# Altium project fader2_pcb.PrjPcb (part 1 of 2)
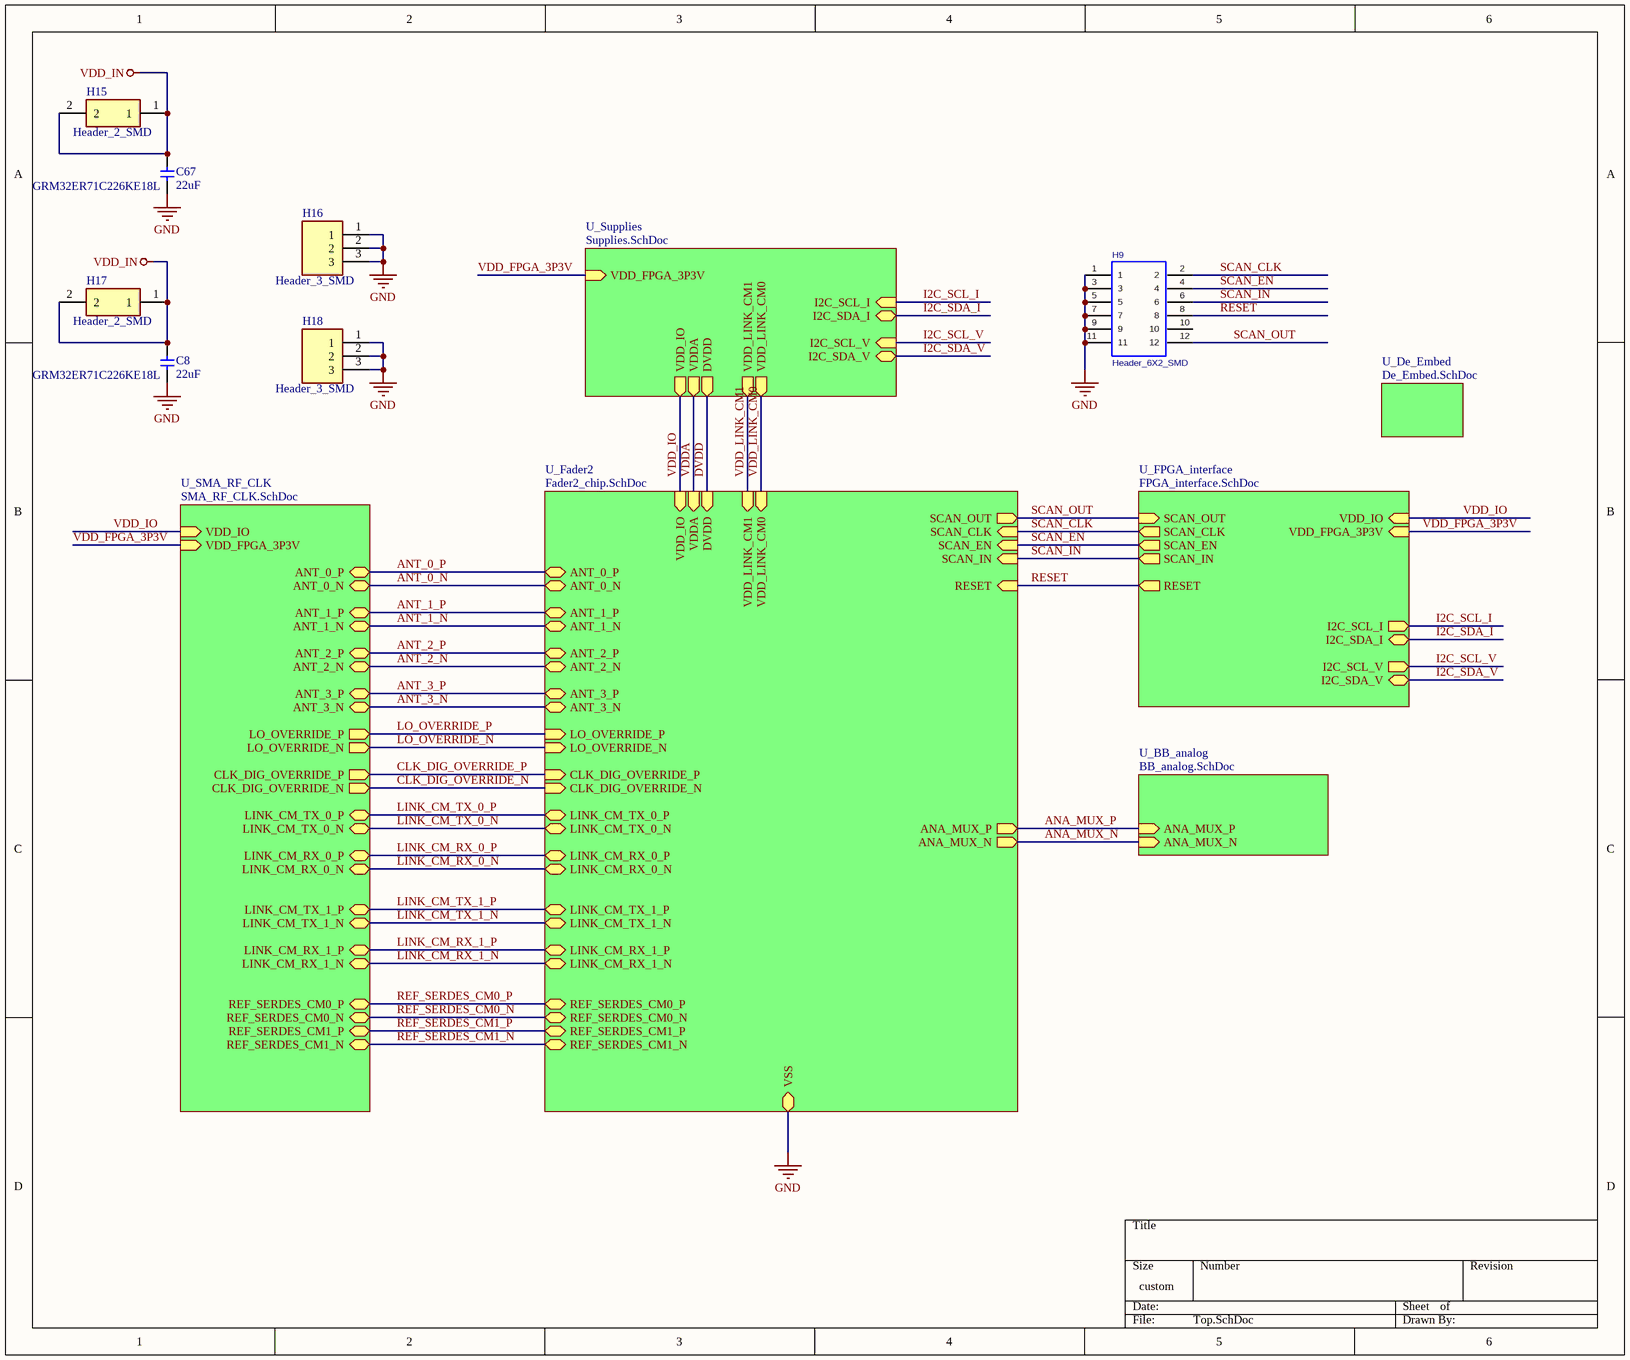
[diagram p0: Top.SchDoc]
10 sheets, 206 parts. Net scope: hierarchical (ports join the sheet entries above them; power ports are global).
Board file: fader2_blind_vias_pcb.PcbDoc
Sheets:
  Top.SchDoc
    U_SMA_RF_CLK = SMA_RF_CLK.SchDoc
    U_FPGA_interface = FPGA_interface.SchDoc
      U_Lvl_Shifters = Lvl_Shifters.SchDoc
    U_Supplies = Supplies.SchDoc
      U_Supplies_LDO = Supplies_LDOs.SchDoc
      U_Supplies_Isense = Supplies_Isense.SchDoc
      U_Supplies_Pots = Supplies_Pots.SchDoc
    U_De_Embed = De_Embed.SchDoc
    U_BB_analog = BB_analog.SchDoc

## Sheet Top.SchDoc
size 304 x 254 mm

### Parts
C8  22uF  Supplier Part Number 1: GRM32ER71C226KE18L  [CAPC3225X27N]
C67  22uF  Supplier Part Number 1: GRM32ER71C226KE18L  [CAPC3225X27N]
H9  Header_6X2_SMD  [HDR2X6_SMD]
H15  Header_2_SMD  [HDR1X2_SMD_S]
H16  Header_3_SMD  [HDR1X3_SMD]
H17  Header_2_SMD  [HDR1X2_SMD_S]
H18  Header_3_SMD  [HDR1X3_SMD]

### Sub-sheets
U_BB_analog = BB_analog.SchDoc: ANA_MUX_N (in), ANA_MUX_P (in)
U_De_Embed = De_Embed.SchDoc: no entries
U_Fader2 = Fader2_chip.SchDoc (file not in this document): VSS (bidir), SCAN_OUT (out), SCAN_CLK (in), SCAN_EN (in), SCAN_IN (in), ANT_2_N (bidir), LINK_CM_RX_0_N (bidir), LINK_CM_TX_0_P (bidir), LINK_CM_RX_0_P (bidir), RESET (in), LINK_CM_TX_0_N (bidir), ANT_1_N (bidir), ANT_2_P (bidir), ANT_3_N (bidir), ANT_0_P (bidir), ANT_3_P (bidir), ANT_1_P (bidir), ANT_0_N (bidir), CLK_DIG_OVERRIDE_P (in), LO_OVERRIDE_N (in), ANA_MUX_N (out), ANA_MUX_P (out), LO_OVERRIDE_P (in), CLK_DIG_OVERRIDE_N (in), DVDD (in), VDD_IO (in), VDDA (in), VDD_LINK_CM0 (in), VDD_LINK_CM1 (in), LINK_CM_TX_1_P (bidir), LINK_CM_TX_1_N (bidir), LINK_CM_RX_1_P (bidir), LINK_CM_RX_1_N (bidir), REF_SERDES_CM1_N (bidir), REF_SERDES_CM1_P (bidir), REF_SERDES_CM0_N (bidir), REF_SERDES_CM0_P (bidir)
U_FPGA_interface = FPGA_interface.SchDoc: I2C_SDA_I (bidir), I2C_SDA_V (bidir), VDD_FPGA_3P3V (in), VDD_IO (in), I2C_SCL_V (out), I2C_SCL_I (out), SCAN_OUT (in), RESET (out), SCAN_EN (out), SCAN_IN (out), SCAN_CLK (out)
U_SMA_RF_CLK = SMA_RF_CLK.SchDoc: LO_OVERRIDE_P (out), CLK_DIG_OVERRIDE_N (out), CLK_DIG_OVERRIDE_P (out), LO_OVERRIDE_N (out), VDD_IO (in), VDD_FPGA_3P3V (in), ANT_3_N (bidir), ANT_3_P (bidir), ANT_1_P (bidir), ANT_2_N (bidir), ANT_0_N (bidir), ANT_1_N (bidir), ANT_0_P (bidir), ANT_2_P (bidir), LINK_CM_RX_0_N (bidir), LINK_CM_RX_0_P (bidir), LINK_CM_TX_0_N (bidir), LINK_CM_TX_0_P (bidir), LINK_CM_RX_1_N (bidir), LINK_CM_RX_1_P (bidir), LINK_CM_TX_1_N (bidir), LINK_CM_TX_1_P (bidir), REF_SERDES_CM0_N (bidir), REF_SERDES_CM1_P (bidir), REF_SERDES_CM1_N (bidir), REF_SERDES_CM0_P (bidir)
U_Supplies = Supplies.SchDoc: I2C_SDA_I (bidir), I2C_SDA_V (bidir), VDD_FPGA_3P3V (in), DVDD (out), VDDA (out), VDD_IO (out), I2C_SCL_V (in), I2C_SCL_I (in), VDD_LINK_CM1 (out), VDD_LINK_CM0 (out)

### Nets
GND: C8.2 C67.2 H9.1 H9.3 H9.5 H9.7 H9.9 H9.11 H16.1 H16.2 H16.3 H18.1 H18.2 H18.3 ; sheet U_Fader2/VSS
VDD_IN: C8.1 C67.1 H15.1 H15.2 H17.1 H17.2
ANA_MUX_N: sheet U_Fader2/ANA_MUX_N, sheet U_BB_analog/ANA_MUX_N
ANA_MUX_P: sheet U_Fader2/ANA_MUX_P, sheet U_BB_analog/ANA_MUX_P
ANT_0_N: sheet U_Fader2/ANT_0_N, sheet U_SMA_RF_CLK/ANT_0_N
ANT_0_P: sheet U_Fader2/ANT_0_P, sheet U_SMA_RF_CLK/ANT_0_P
ANT_1_N: sheet U_Fader2/ANT_1_N, sheet U_SMA_RF_CLK/ANT_1_N
ANT_1_P: sheet U_Fader2/ANT_1_P, sheet U_SMA_RF_CLK/ANT_1_P
ANT_2_N: sheet U_Fader2/ANT_2_N, sheet U_SMA_RF_CLK/ANT_2_N
ANT_2_P: sheet U_Fader2/ANT_2_P, sheet U_SMA_RF_CLK/ANT_2_P
ANT_3_N: sheet U_Fader2/ANT_3_N, sheet U_SMA_RF_CLK/ANT_3_N
ANT_3_P: sheet U_Fader2/ANT_3_P, sheet U_SMA_RF_CLK/ANT_3_P
CLK_DIG_OVERRIDE_N: sheet U_Fader2/CLK_DIG_OVERRIDE_N, sheet U_SMA_RF_CLK/CLK_DIG_OVERRIDE_N
CLK_DIG_OVERRIDE_P: sheet U_Fader2/CLK_DIG_OVERRIDE_P, sheet U_SMA_RF_CLK/CLK_DIG_OVERRIDE_P
DVDD: sheet U_Fader2/DVDD, sheet U_Supplies/DVDD
I2C_SCL_I: sheet U_FPGA_interface/I2C_SCL_I, sheet U_Supplies/I2C_SCL_I
I2C_SCL_V: sheet U_FPGA_interface/I2C_SCL_V, sheet U_Supplies/I2C_SCL_V
I2C_SDA_I: sheet U_FPGA_interface/I2C_SDA_I, sheet U_Supplies/I2C_SDA_I
I2C_SDA_V: sheet U_FPGA_interface/I2C_SDA_V, sheet U_Supplies/I2C_SDA_V
LINK_CM_RX_0_N: sheet U_Fader2/LINK_CM_RX_0_N, sheet U_SMA_RF_CLK/LINK_CM_RX_0_N
LINK_CM_RX_0_P: sheet U_Fader2/LINK_CM_RX_0_P, sheet U_SMA_RF_CLK/LINK_CM_RX_0_P
LINK_CM_RX_1_N: sheet U_Fader2/LINK_CM_RX_1_N, sheet U_SMA_RF_CLK/LINK_CM_RX_1_N
LINK_CM_RX_1_P: sheet U_Fader2/LINK_CM_RX_1_P, sheet U_SMA_RF_CLK/LINK_CM_RX_1_P
LINK_CM_TX_0_N: sheet U_Fader2/LINK_CM_TX_0_N, sheet U_SMA_RF_CLK/LINK_CM_TX_0_N
LINK_CM_TX_0_P: sheet U_Fader2/LINK_CM_TX_0_P, sheet U_SMA_RF_CLK/LINK_CM_TX_0_P
LINK_CM_TX_1_N: sheet U_Fader2/LINK_CM_TX_1_N, sheet U_SMA_RF_CLK/LINK_CM_TX_1_N
LINK_CM_TX_1_P: sheet U_Fader2/LINK_CM_TX_1_P, sheet U_SMA_RF_CLK/LINK_CM_TX_1_P
LO_OVERRIDE_N: sheet U_Fader2/LO_OVERRIDE_N, sheet U_SMA_RF_CLK/LO_OVERRIDE_N
LO_OVERRIDE_P: sheet U_Fader2/LO_OVERRIDE_P, sheet U_SMA_RF_CLK/LO_OVERRIDE_P
REF_SERDES_CM0_N: sheet U_Fader2/REF_SERDES_CM0_N, sheet U_SMA_RF_CLK/REF_SERDES_CM0_N
REF_SERDES_CM0_P: sheet U_Fader2/REF_SERDES_CM0_P, sheet U_SMA_RF_CLK/REF_SERDES_CM0_P
REF_SERDES_CM1_N: sheet U_Fader2/REF_SERDES_CM1_N, sheet U_SMA_RF_CLK/REF_SERDES_CM1_N
REF_SERDES_CM1_P: sheet U_Fader2/REF_SERDES_CM1_P, sheet U_SMA_RF_CLK/REF_SERDES_CM1_P
RESET: H9.8 ; sheet U_Fader2/RESET, sheet U_FPGA_interface/RESET
SCAN_CLK: H9.2 ; sheet U_Fader2/SCAN_CLK, sheet U_FPGA_interface/SCAN_CLK
SCAN_EN: H9.4 ; sheet U_Fader2/SCAN_EN, sheet U_FPGA_interface/SCAN_EN
SCAN_IN: H9.6 ; sheet U_Fader2/SCAN_IN, sheet U_FPGA_interface/SCAN_IN
SCAN_OUT: H9.12 ; sheet U_Fader2/SCAN_OUT, sheet U_FPGA_interface/SCAN_OUT
VDD_FPGA_3P3V: sheet U_SMA_RF_CLK/VDD_FPGA_3P3V, sheet U_FPGA_interface/VDD_FPGA_3P3V, sheet U_Supplies/VDD_FPGA_3P3V
VDD_IO: sheet U_Fader2/VDD_IO, sheet U_SMA_RF_CLK/VDD_IO, sheet U_FPGA_interface/VDD_IO, sheet U_Supplies/VDD_IO
VDD_LINK_CM0: sheet U_Fader2/VDD_LINK_CM0, sheet U_Supplies/VDD_LINK_CM0
VDD_LINK_CM1: sheet U_Fader2/VDD_LINK_CM1, sheet U_Supplies/VDD_LINK_CM1
VDDA: sheet U_Fader2/VDDA, sheet U_Supplies/VDDA

Not connected (* = marked no-connect by the designer): H9 10

### Library data of the parts
C8 C67 = cap 22uF: CAP CER 22uF 10% 16V X7R 1210; Manufacturer: Murata; Manufacturer ID: GRM32ER71C226KE18L; Digikey ID: 490-4524-1-ND; Value: 22uF; Package: 1210; Supplier 1: Arrow
H9 = Header_6X2_SMD: Connector Header Vertical Dual Row, SMD, 12 position 0.100" (2.54mm); MANUFACTURER: SAMTEC; PCB DECAL: TSM-106-XX-XXX-DV; Supplier 1: Digi-Key; Supplier Part Number 1: SAM10803-ND; CREATED: November 23, 2017 - Wendy Xin
H15 H17 = Header_2_SMD: Connector Header Vertical, SMD, 2 position 0.100" (2.54mm); Manufacturer_Name: SAMTEC; Manufacturer_Part_Number: TSM-102-01-S-SV; Datasheet Link: https://componentsearchengine.com/Datasheets/2/TSM-102-01-S-SV.pdf; Arrow Part Number: TSM-102-01-S-SV; Arrow Price/Stock: https://www.arrow.com/en/products/tsm-102-01-s-sv/samtec; Mouser Part Number: 200-TSM10201SSV; Mouser Price/Stock: https://www.mouser.co.uk/ProductDetail/Samtec/TSM-102-01-S-SV?qs=FESYatJ8odJNSemiJZ%2Fyzw%3D%3D; Supplier 1: Digi-Key; Supplier Part Number 1: SAM10783-ND
H16 H18 = Header_3_SMD: Connector Header Vertical, SMD, 3 position 0.100" (2.54mm); Manufacturer_Name: SAMTEC; Manufacturer_Part_Number: TSM-103-01-S-SV-P-TR; Datasheet Link: http://suddendocs.samtec.com/prints/tsm-1xx-xx-xxx-sv-xx-xxx-xx-mkt.pdf; Height: 11.17mm; Arrow Part Number: TSM-103-01-S-SV-P-TR; Arrow Price/Stock: https://www.arrow.com/en/products/tsm-103-01-s-sv-p-tr/samtec; Mouser Part Number: 200-TSM10301SSVPTR; Mouser Price/Stock: https://www.mouser.co.uk/ProductDetail/Samtec/TSM-103-01-S-SV-P-TR?qs=FESYatJ8odJI6Ns4akqicQ%3D%3D; Supplier 1: Newark; Supplier 2: Digi-Key; Supplier Part Number 1: 80K8300; Supplier Part Number 2: SAM13283CT-ND

## Sheet SMA_RF_CLK.SchDoc
size 330 x 1066 mm
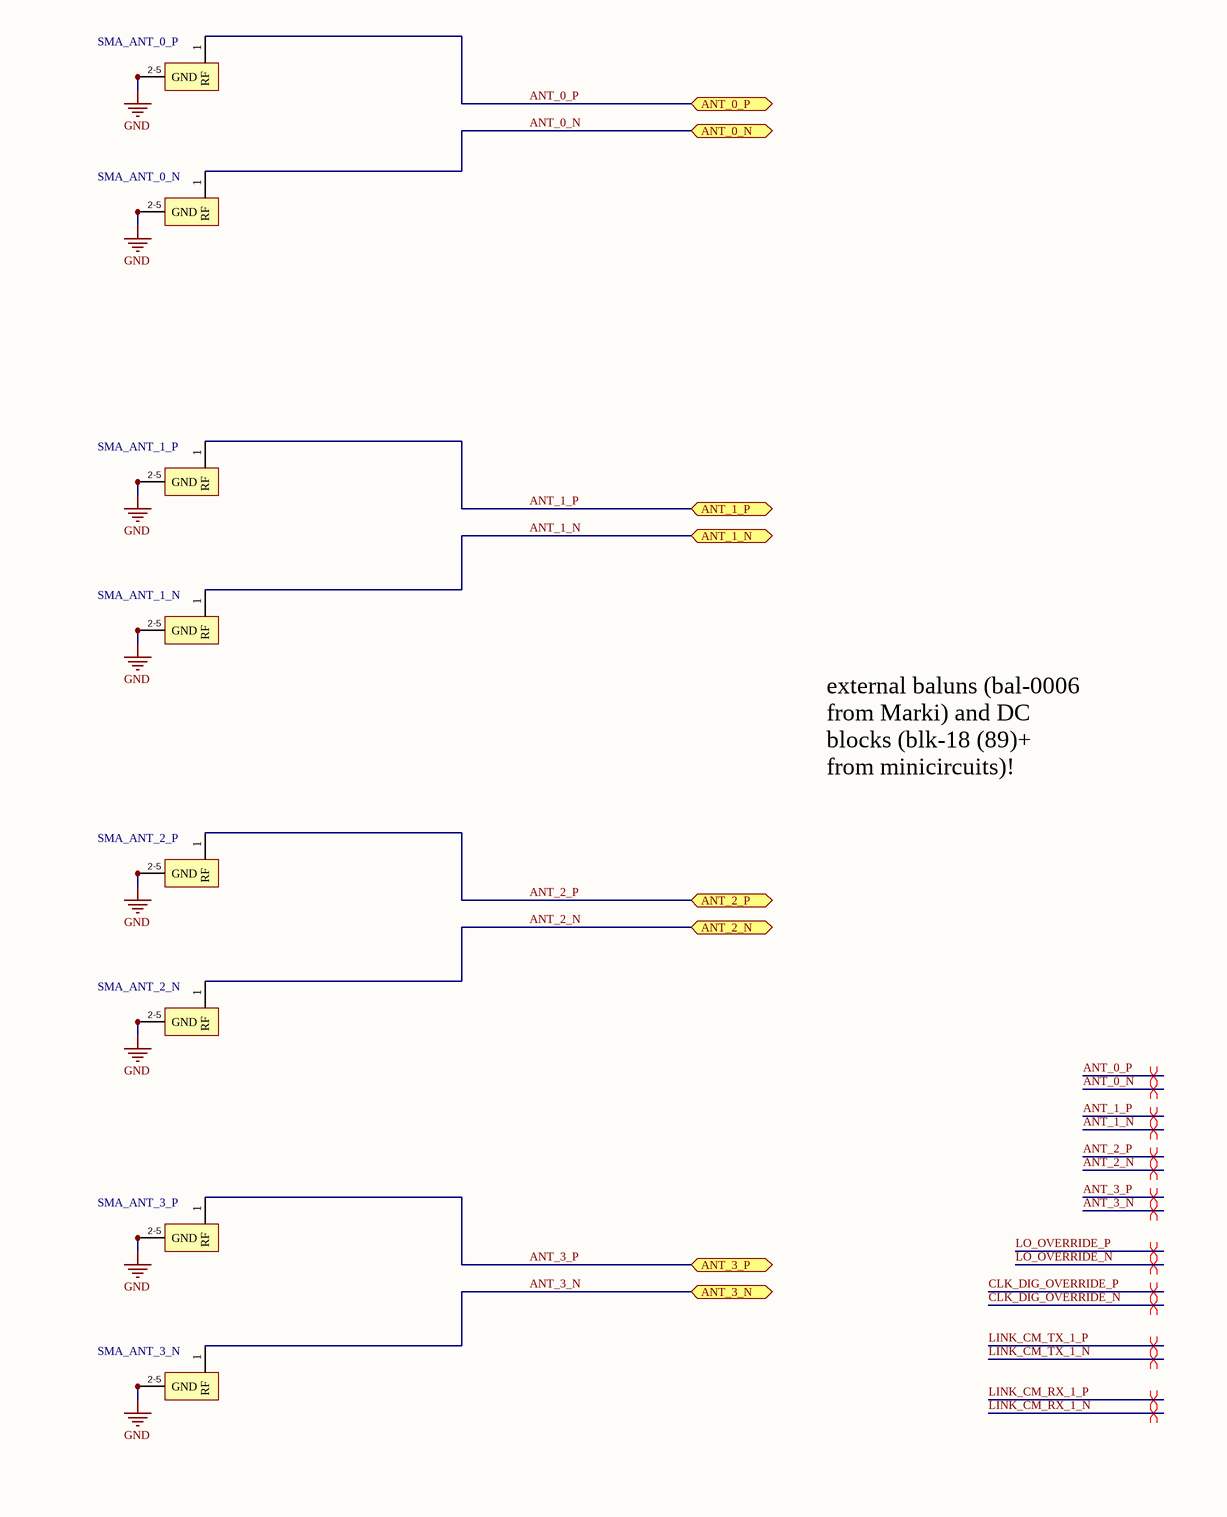
[diagram p1: SMA_RF_CLK.SchDoc, top]
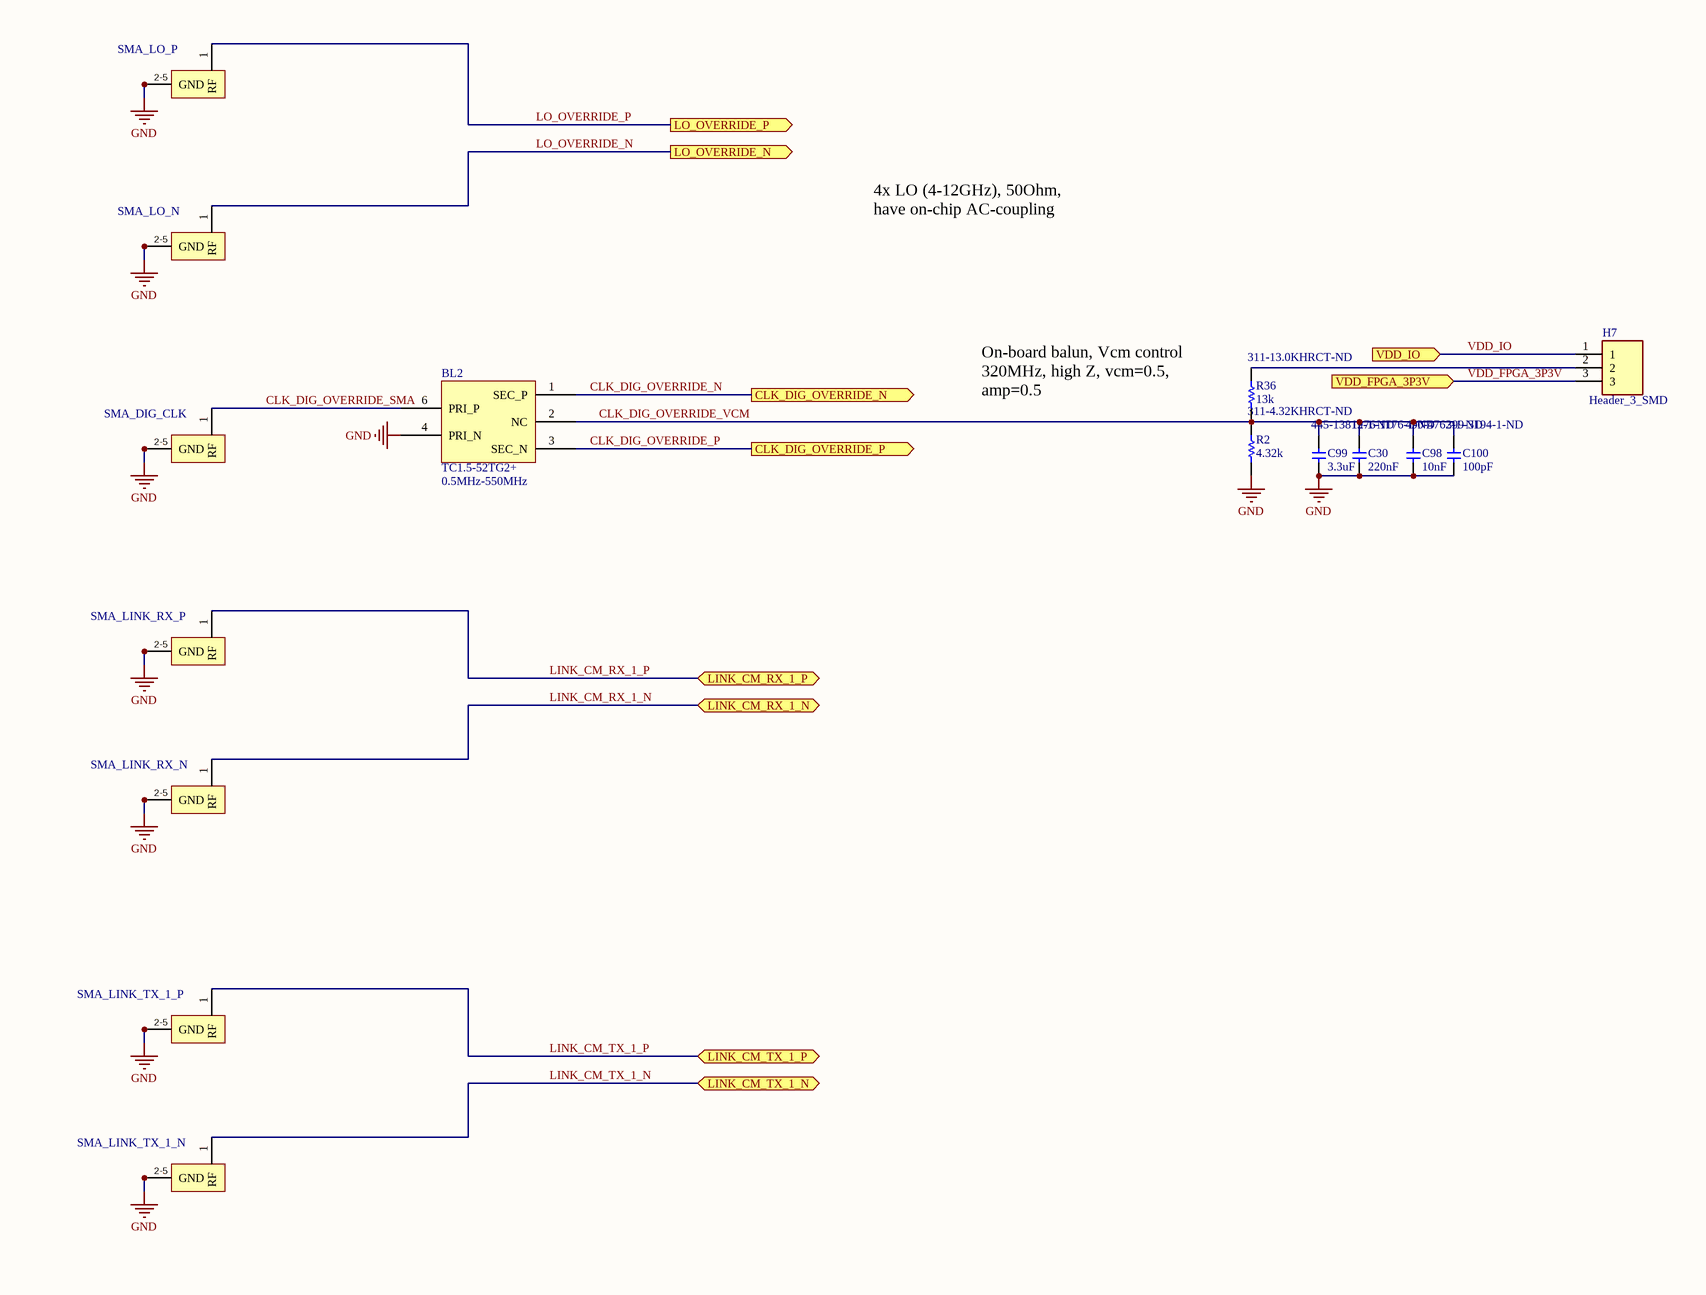
[diagram p2: SMA_RF_CLK.SchDoc, centre]
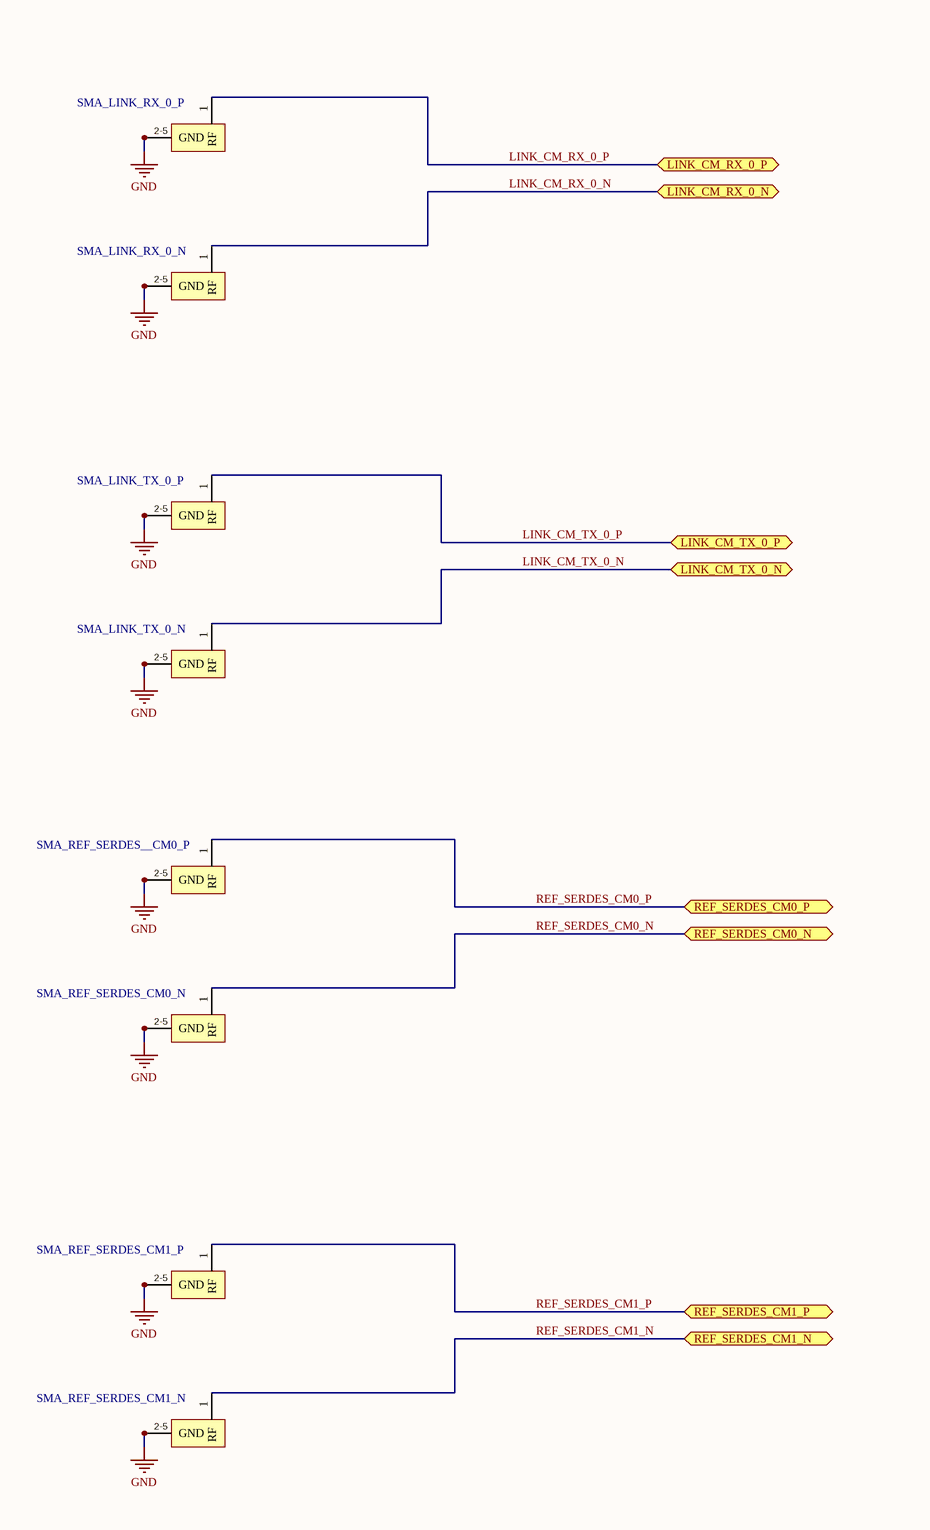
[diagram p3: SMA_RF_CLK.SchDoc, bottom]

### Parts
BL2  TC1.5-52TG2+  Frequency Range: 0.5MHz-550MHz  [AT224-3]
C30  220nF  Supplier Part Number 1: 1276-1176-1-ND  [CAP_0402]
C98  10nF  Supplier Part Number 1: 490-4762-1-ND  [CAPC1005X06L_HD]
C99  3.3uF  Supplier Part Number 1: 445-13819-1-ND  [CAP_0402]
C100  100pF  Supplier Part Number 1: 399-3194-1-ND  [CAPC1005X06L_HD]
H7  Header_3_SMD  [HDR1X3_SMD]
R2  4.32k  Supplier Part Number 1: 311-4.32KHRCT-ND  [RES_0603]
R36  13k  Supplier Part Number 1: 311-13.0KHRCT-ND  [RES_0603]
SMA_ANT_0_N  CONSMA001-SMD-G  [CON-SMA-SMD]  (value not drawn)
SMA_ANT_0_P  CONSMA001-SMD-G  [CON-SMA-SMD]  (value not drawn)
SMA_ANT_1_N  CONSMA001-SMD-G  [CON-SMA-SMD]  (value not drawn)
SMA_ANT_1_P  CONSMA001-SMD-G  [CON-SMA-SMD]  (value not drawn)
SMA_ANT_2_N  CONSMA001-SMD-G  [CON-SMA-SMD]  (value not drawn)
SMA_ANT_2_P  CONSMA001-SMD-G  [CON-SMA-SMD]  (value not drawn)
SMA_ANT_3_N  CONSMA001-SMD-G  [CON-SMA-SMD]  (value not drawn)
SMA_ANT_3_P  CONSMA001-SMD-G  [CON-SMA-SMD]  (value not drawn)
SMA_DIG_CLK  CONSMA001-SMD-G  [CON-SMA-SMD]  (value not drawn)
SMA_LINK_RX_0_N  CONSMA001-SMD-G  [CON-SMA-SMD]  (value not drawn)
SMA_LINK_RX_0_P  CONSMA001-SMD-G  [CON-SMA-SMD]  (value not drawn)
SMA_LINK_RX_N  CONSMA001-SMD-G  [CON-SMA-SMD]  (value not drawn)
SMA_LINK_RX_P  CONSMA001-SMD-G  [CON-SMA-SMD]  (value not drawn)
SMA_LINK_TX_0_N  CONSMA001-SMD-G  [CON-SMA-SMD]  (value not drawn)
SMA_LINK_TX_0_P  CONSMA001-SMD-G  [CON-SMA-SMD]  (value not drawn)
SMA_LINK_TX_1_N  CONSMA001-SMD-G  [CON-SMA-SMD]  (value not drawn)
SMA_LINK_TX_1_P  CONSMA001-SMD-G  [CON-SMA-SMD]  (value not drawn)
SMA_LO_N  CONSMA001-SMD-G  [CON-SMA-SMD]  (value not drawn)
SMA_LO_P  CONSMA001-SMD-G  [CON-SMA-SMD]  (value not drawn)
SMA_REF_SERDES__CM0_P  CONSMA001-SMD-G  [CON-SMA-SMD]  (value not drawn)
SMA_REF_SERDES_CM0_N  CONSMA001-SMD-G  [CON-SMA-SMD]  (value not drawn)
SMA_REF_SERDES_CM1_N  CONSMA001-SMD-G  [CON-SMA-SMD]  (value not drawn)
SMA_REF_SERDES_CM1_P  CONSMA001-SMD-G  [CON-SMA-SMD]  (value not drawn)

### Ports
ANT_0_N (bidir), ANT_0_P (bidir), ANT_1_N (bidir), ANT_1_P (bidir), ANT_2_N (bidir), ANT_2_P (bidir), ANT_3_N (bidir), ANT_3_P (bidir), CLK_DIG_OVERRIDE_N (out), CLK_DIG_OVERRIDE_P (out), LINK_CM_RX_0_N (bidir), LINK_CM_RX_0_P (bidir), LINK_CM_RX_1_N (bidir), LINK_CM_RX_1_P (bidir), LINK_CM_TX_0_N (bidir), LINK_CM_TX_0_P (bidir), LINK_CM_TX_1_N (bidir), LINK_CM_TX_1_P (bidir), LO_OVERRIDE_N (out), LO_OVERRIDE_P (out), REF_SERDES_CM0_N (bidir), REF_SERDES_CM0_P (bidir), REF_SERDES_CM1_N (bidir), REF_SERDES_CM1_P (bidir), VDD_FPGA_3P3V (in), VDD_IO (in)

### Nets
GND: BL2.4(PRI_N) C30.2 C98.2 C99.2 C100.2 R2.2(BOT) SMA_ANT_0_N.2(GND) SMA_ANT_0_N.3(GND) SMA_ANT_0_N.4(GND) SMA_ANT_0_N.5(GND) SMA_ANT_0_P.2(GND) SMA_ANT_0_P.3(GND) SMA_ANT_0_P.4(GND) SMA_ANT_0_P.5(GND) SMA_ANT_1_N.2(GND) SMA_ANT_1_N.3(GND) SMA_ANT_1_N.4(GND) SMA_ANT_1_N.5(GND) SMA_ANT_1_P.2(GND) SMA_ANT_1_P.3(GND) SMA_ANT_1_P.4(GND) SMA_ANT_1_P.5(GND) SMA_ANT_2_N.2(GND) SMA_ANT_2_N.3(GND) SMA_ANT_2_N.4(GND) SMA_ANT_2_N.5(GND) SMA_ANT_2_P.2(GND) SMA_ANT_2_P.3(GND) SMA_ANT_2_P.4(GND) SMA_ANT_2_P.5(GND) SMA_ANT_3_N.2(GND) SMA_ANT_3_N.3(GND) SMA_ANT_3_N.4(GND) SMA_ANT_3_N.5(GND) SMA_ANT_3_P.2(GND) SMA_ANT_3_P.3(GND) SMA_ANT_3_P.4(GND) SMA_ANT_3_P.5(GND) SMA_DIG_CLK.2(GND) SMA_DIG_CLK.3(GND) SMA_DIG_CLK.4(GND) SMA_DIG_CLK.5(GND) SMA_LINK_RX_0_N.2(GND) SMA_LINK_RX_0_N.3(GND) SMA_LINK_RX_0_N.4(GND) SMA_LINK_RX_0_N.5(GND) SMA_LINK_RX_0_P.2(GND) SMA_LINK_RX_0_P.3(GND) SMA_LINK_RX_0_P.4(GND) SMA_LINK_RX_0_P.5(GND) SMA_LINK_RX_N.2(GND) SMA_LINK_RX_N.3(GND) SMA_LINK_RX_N.4(GND) SMA_LINK_RX_N.5(GND) SMA_LINK_RX_P.2(GND) SMA_LINK_RX_P.3(GND) SMA_LINK_RX_P.4(GND) SMA_LINK_RX_P.5(GND) SMA_LINK_TX_0_N.2(GND) SMA_LINK_TX_0_N.3(GND) SMA_LINK_TX_0_N.4(GND) SMA_LINK_TX_0_N.5(GND) SMA_LINK_TX_0_P.2(GND) SMA_LINK_TX_0_P.3(GND) SMA_LINK_TX_0_P.4(GND) SMA_LINK_TX_0_P.5(GND) SMA_LINK_TX_1_N.2(GND) SMA_LINK_TX_1_N.3(GND) SMA_LINK_TX_1_N.4(GND) SMA_LINK_TX_1_N.5(GND) SMA_LINK_TX_1_P.2(GND) SMA_LINK_TX_1_P.3(GND) SMA_LINK_TX_1_P.4(GND) SMA_LINK_TX_1_P.5(GND) SMA_LO_N.2(GND) SMA_LO_N.3(GND) SMA_LO_N.4(GND) SMA_LO_N.5(GND) SMA_LO_P.2(GND) SMA_LO_P.3(GND) SMA_LO_P.4(GND) SMA_LO_P.5(GND) SMA_REF_SERDES__CM0_P.2(GND) SMA_REF_SERDES__CM0_P.3(GND) SMA_REF_SERDES__CM0_P.4(GND) SMA_REF_SERDES__CM0_P.5(GND) SMA_REF_SERDES_CM0_N.2(GND) SMA_REF_SERDES_CM0_N.3(GND) SMA_REF_SERDES_CM0_N.4(GND) SMA_REF_SERDES_CM0_N.5(GND) SMA_REF_SERDES_CM1_N.2(GND) SMA_REF_SERDES_CM1_N.3(GND) SMA_REF_SERDES_CM1_N.4(GND) SMA_REF_SERDES_CM1_N.5(GND) SMA_REF_SERDES_CM1_P.2(GND) SMA_REF_SERDES_CM1_P.3(GND) SMA_REF_SERDES_CM1_P.4(GND) SMA_REF_SERDES_CM1_P.5(GND)
ANT_0_N: SMA_ANT_0_N.1(RF) ; port ANT_0_N
ANT_0_P: SMA_ANT_0_P.1(RF) ; port ANT_0_P
ANT_1_N: SMA_ANT_1_N.1(RF) ; port ANT_1_N
ANT_1_P: SMA_ANT_1_P.1(RF) ; port ANT_1_P
ANT_2_N: SMA_ANT_2_N.1(RF) ; port ANT_2_N
ANT_2_P: SMA_ANT_2_P.1(RF) ; port ANT_2_P
ANT_3_N: SMA_ANT_3_N.1(RF) ; port ANT_3_N
ANT_3_P: SMA_ANT_3_P.1(RF) ; port ANT_3_P
CLK_DIG_OVERRIDE_N: BL2.1(SEC_P) ; port CLK_DIG_OVERRIDE_N
CLK_DIG_OVERRIDE_P: BL2.3(SEC_N) ; port CLK_DIG_OVERRIDE_P
CLK_DIG_OVERRIDE_SMA: BL2.6(PRI_P) SMA_DIG_CLK.1(RF)
CLK_DIG_OVERRIDE_VCM: BL2.2(NC) C30.1 C98.1 C99.1 C100.1 R2.1(TOP) R36.2(BOT)
LINK_CM_RX_0_N: SMA_LINK_RX_0_N.1(RF) ; port LINK_CM_RX_0_N
LINK_CM_RX_0_P: SMA_LINK_RX_0_P.1(RF) ; port LINK_CM_RX_0_P
LINK_CM_RX_1_N: SMA_LINK_RX_N.1(RF) ; port LINK_CM_RX_1_N
LINK_CM_RX_1_P: SMA_LINK_RX_P.1(RF) ; port LINK_CM_RX_1_P
LINK_CM_TX_0_N: SMA_LINK_TX_0_N.1(RF) ; port LINK_CM_TX_0_N
LINK_CM_TX_0_P: SMA_LINK_TX_0_P.1(RF) ; port LINK_CM_TX_0_P
LINK_CM_TX_1_N: SMA_LINK_TX_1_N.1(RF) ; port LINK_CM_TX_1_N
LINK_CM_TX_1_P: SMA_LINK_TX_1_P.1(RF) ; port LINK_CM_TX_1_P
LO_OVERRIDE_N: SMA_LO_N.1(RF) ; port LO_OVERRIDE_N
LO_OVERRIDE_P: SMA_LO_P.1(RF) ; port LO_OVERRIDE_P
REF_SERDES_CM0_N: SMA_REF_SERDES_CM0_N.1(RF) ; port REF_SERDES_CM0_N
REF_SERDES_CM0_P: SMA_REF_SERDES__CM0_P.1(RF) ; port REF_SERDES_CM0_P
REF_SERDES_CM1_N: SMA_REF_SERDES_CM1_N.1(RF) ; port REF_SERDES_CM1_N
REF_SERDES_CM1_P: SMA_REF_SERDES_CM1_P.1(RF) ; port REF_SERDES_CM1_P
VDD_FPGA_3P3V: H7.3 ; port VDD_FPGA_3P3V
VDD_IO: H7.1 ; port VDD_IO
NetH7_2: H7.2 R36.1(TOP)

### Layout directives
differential pair: ANT_0_N, ANT_0_P, ANT_1_N, ANT_1_P, ANT_2_N, ANT_2_P, ANT_3_N, ANT_3_P, CLK_DIG_OVERRIDE_N, CLK_DIG_OVERRIDE_P, LINK_CM_RX_1_N, LINK_CM_RX_1_P, LINK_CM_TX_1_N, LINK_CM_TX_1_P, LO_OVERRIDE_N, LO_OVERRIDE_P

### Notes on the sheet
- external baluns (bal-0006 from Marki) and DC blocks (blk-18 (89)+ from minicircuits)!
- 4x LO (4-12GHz), 50Ohm, have on-chip AC-coupling cap
- On-board balun, Vcm control
  320MHz, high Z, vcm=0.5, amp=0.5
- (in symbol SURFACE MOUNT SMA CONNECTOR) 2-5

### Library data of the parts
BL2 = TC1.5-52TG2+: Balun, 1:1.5 CORE & WIRE Transformer, 0.5 - 550 MHz, 50Ω; Manufacturer: Mini-Circuits; Manufacturer ID: TC1.5-52TG2+
C30 = cap 220nF: CAP CER 0.22uF 10% 16V X7R 0402; Manufacturer: Samsung Electro-Mechanics; Manufacturer ID: CL05B224KO5NNNC; Digikey ID: 1276-1176-1-ND; Value: 0.22uF; Package: 0402; Supplier 1: Digi-Key
C98 = cap 10nF: CAP CER 10nF 10% 50V X7R 0402; Manufacturer: Murata; Manufacturer ID: GCM155R71H103KA55D; Value: 10000pF; Digikey ID: 490-4762-1-ND; Package: 0402; Supplier 1: Digi-Key
C99 = cap 3p3uF: CAP CER 3.3uF 10% 10V X5R 0402; Manufacturer: TDK; Manufacturer ID: C1005X5R1A335K050BC; Digikey ID: 445-13819-1-ND; Value: 3.3uF; Package: 0402; Supplier 1: Digi-Key
C100 = cap 100pF 0402: CAP CER 100pF 5% 50V C0G/NP0 0402; Manufacturer: Kemet; Manufacturer ID: C0402C101J5GACTU; Digikey ID: 399-3194-1-ND; Value: 100pF; Package: 0402; Supplier 1: Digi-Key
H7 = Header_3_SMD: as H16 on sheet Top; Supplier 1: Newark; Supplier Part Number 1: 80K8300; Datasheet Link: http://suddendocs.samtec.com/prints/tsm-1xx-xx-xxx-sv-xx-xxx-xx-mkt.pdf; Height: 11.17mm; Arrow Part Number: TSM-103-01-S-SV-P-TR; Arrow Price/Stock: https://www.arrow.com/en/products/tsm-103-01-s-sv-p-tr/samtec; Mouser Part Number: 200-TSM10301SSVPTR; Mouser Price/Stock: https://www.mouser.co.uk/ProductDetail/Samtec/TSM-103-01-S-SV-P-TR?qs=FESYatJ8odJI6Ns4akqicQ%3D%3D; Supplier 2: Digi-Key; Supplier Part Number 2: SAM13283CT-ND
R2 = res 4.32 kOhm_1: RES SMD 4.32kOHM 1% 1/10W 0603; Package: 0603; Supplier 1: Digi-Key; Supplier 2: Digi-Key; Supplier Part Number 2: 541-4.32KHCT-ND
R36 = res 13 kOhm_1: RES SMD 13k OHM 1% 1/10W 0603; Package: 0603; Supplier 1: Digi-Key; Supplier 2: Digi-Key; Supplier Part Number 2: 541-13.0KHCT-ND
SMA_ANT_0_N SMA_ANT_0_P SMA_ANT_1_N SMA_ANT_1_P SMA_ANT_2_N SMA_ANT_2_P SMA_ANT_3_N SMA_ANT_3_P SMA_DIG_CLK SMA_LINK_RX_0_N SMA_LINK_RX_0_P SMA_LINK_RX_N SMA_LINK_RX_P SMA_LINK_TX_0_N SMA_LINK_TX_0_P SMA_LINK_TX_1_N SMA_LINK_TX_1_P SMA_LO_N SMA_LO_P SMA_REF_SERDES__CM0_P SMA_REF_SERDES_CM0_N SMA_REF_SERDES_CM1_N SMA_REF_SERDES_CM1_P = SURFACE MOUNT SMA CONNECTOR: SMD SMA CONNECTOR; Manufacturer 1: Linx Technologies; Supplier 1: Digi-Key; Supplier Part Number 1: CONSMA001-SMD-ND; Manufacturer Part Number 1: CONSMA001-SMD-G; Manufacturer Part Number 2: CONSMA002-SMD; Supplier Part Number 2: CONSMA002-SMD-ND

## Sheet FPGA_interface.SchDoc
size A
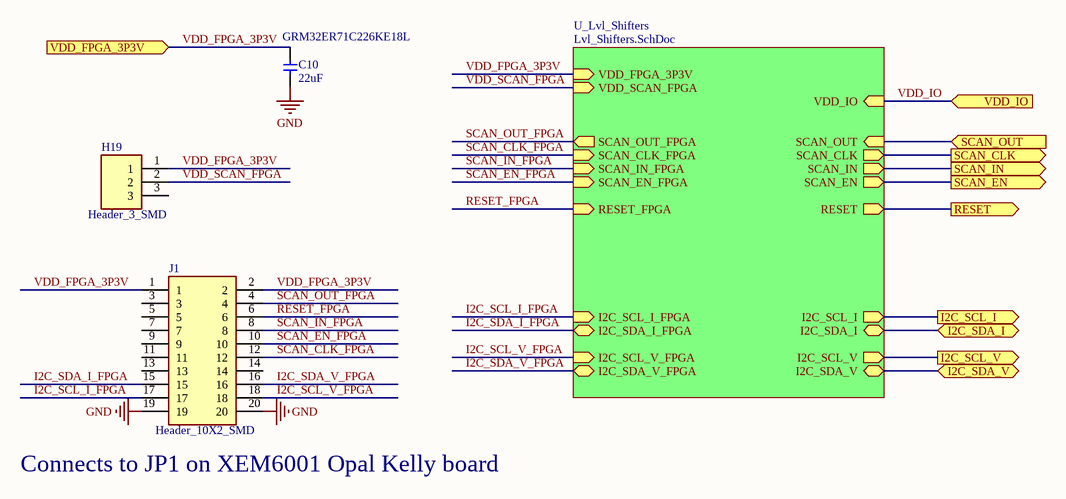
[diagram p4: FPGA_interface.SchDoc]

### Parts
C10  22uF  Supplier Part Number 1: GRM32ER71C226KE18L  [CAPC3225X27N]
H19  Header_3_SMD  [HDR1X3_SMD]
J1  Header_10X2_SMD  [HDR2X10_SMD]

### Sub-sheets
U_Lvl_Shifters = Lvl_Shifters.SchDoc: I2C_SDA_I_FPGA (bidir), I2C_SDA_I (bidir), I2C_SDA_V (bidir), I2C_SDA_V_FPGA (bidir), SCAN_IN_FPGA (in), SCAN_EN_FPGA (in), RESET_FPGA (in), SCAN_OUT_FPGA (out), SCAN_CLK_FPGA (in), VDD_SCAN_FPGA (in), VDD_FPGA_3P3V (in), I2C_SCL_I (out), I2C_SCL_V_FPGA (in), I2C_SCL_V (out), I2C_SCL_I_FPGA (in), VDD_IO (in), SCAN_CLK (out), SCAN_IN (out), RESET (out), SCAN_EN (out), SCAN_OUT (in)

### Ports
I2C_SCL_I (out), I2C_SCL_V (out), I2C_SDA_I (bidir), I2C_SDA_V (bidir), RESET (out), SCAN_CLK (out), SCAN_EN (out), SCAN_IN (out), SCAN_OUT (in), VDD_FPGA_3P3V (in), VDD_IO (in)

### Nets
GND: C10.2 J1.19 J1.20
I2C_SCL_I: port I2C_SCL_I, sheet U_Lvl_Shifters/I2C_SCL_I
I2C_SCL_I_FPGA: J1.17 ; sheet U_Lvl_Shifters/I2C_SCL_I_FPGA
I2C_SCL_V: port I2C_SCL_V, sheet U_Lvl_Shifters/I2C_SCL_V
I2C_SCL_V_FPGA: J1.18 ; sheet U_Lvl_Shifters/I2C_SCL_V_FPGA
I2C_SDA_I: port I2C_SDA_I, sheet U_Lvl_Shifters/I2C_SDA_I
I2C_SDA_I_FPGA: J1.15 ; sheet U_Lvl_Shifters/I2C_SDA_I_FPGA
I2C_SDA_V: port I2C_SDA_V, sheet U_Lvl_Shifters/I2C_SDA_V
I2C_SDA_V_FPGA: J1.16 ; sheet U_Lvl_Shifters/I2C_SDA_V_FPGA
RESET: port RESET, sheet U_Lvl_Shifters/RESET
RESET_FPGA: J1.6 ; sheet U_Lvl_Shifters/RESET_FPGA
SCAN_CLK: port SCAN_CLK, sheet U_Lvl_Shifters/SCAN_CLK
SCAN_CLK_FPGA: J1.12 ; sheet U_Lvl_Shifters/SCAN_CLK_FPGA
SCAN_EN: port SCAN_EN, sheet U_Lvl_Shifters/SCAN_EN
SCAN_EN_FPGA: J1.10 ; sheet U_Lvl_Shifters/SCAN_EN_FPGA
SCAN_IN: port SCAN_IN, sheet U_Lvl_Shifters/SCAN_IN
SCAN_IN_FPGA: J1.8 ; sheet U_Lvl_Shifters/SCAN_IN_FPGA
SCAN_OUT: port SCAN_OUT, sheet U_Lvl_Shifters/SCAN_OUT
SCAN_OUT_FPGA: J1.4 ; sheet U_Lvl_Shifters/SCAN_OUT_FPGA
VDD_FPGA_3P3V: C10.1 H19.1 J1.1 J1.2 ; port VDD_FPGA_3P3V, sheet U_Lvl_Shifters/VDD_FPGA_3P3V
VDD_IO: port VDD_IO, sheet U_Lvl_Shifters/VDD_IO
VDD_SCAN_FPGA: H19.2 ; sheet U_Lvl_Shifters/VDD_SCAN_FPGA

Not connected (* = marked no-connect by the designer): H19 3; J1 3 5 7 9 11 13 14

### Notes on the sheet
- (near J1) Connects to JP1 on XEM6001 Opal Kelly board

### Library data of the parts
C10 = cap 22uF: as C8 on sheet Top; Manufacturer ID: GRM32ER71C226KE18L; Digikey ID: 490-4524-1-ND; Value: 22uF; Package: 1210; Supplier 1: Arrow
H19 = Header_3_SMD: as H16 on sheet Top; Datasheet Link: http://suddendocs.samtec.com/prints/tsm-1xx-xx-xxx-sv-xx-xxx-xx-mkt.pdf; Height: 11.17mm; Arrow Part Number: TSM-103-01-S-SV-P-TR; Arrow Price/Stock: https://www.arrow.com/en/products/tsm-103-01-s-sv-p-tr/samtec; Mouser Part Number: 200-TSM10301SSVPTR; Mouser Price/Stock: https://www.mouser.co.uk/ProductDetail/Samtec/TSM-103-01-S-SV-P-TR?qs=FESYatJ8odJI6Ns4akqicQ%3D%3D; Supplier 1: Newark; Supplier 2: Digi-Key; Supplier Part Number 1: 80K8300; Supplier Part Number 2: SAM13283CT-ND
J1 = Header_10X2_SMD: Connector Header Vertical Dual Row, SMD, 20 position 0.100" (2.54mm); Manufacturer_Name: SAMTEC; Manufacturer_Part_Number: TSM-110-01-L-DV-P-TR; Datasheet Link: http://suddendocs.samtec.com/prints/tsm-1xx-xx-xxx-xx-x-xxx-x-mkt.pdf; Height: 9.9mm; Arrow Part Number: TSM-110-01-L-DV-P-TR; Arrow Price/Stock: https://www.arrow.com/en/products/tsm-110-01-l-dv-p-tr/samtec; Mouser Part Number: 200-TSM11001LDVPTR; Mouser Price/Stock: https://www.mouser.co.uk/ProductDetail/Samtec/TSM-110-01-L-DV-P-TR?qs=0lQeLiL1qyblXKkNLjNUWw%3D%3D; Supplier 1: Digi-Key; Supplier Part Number 1: SAM10819-ND

## Sheet Lvl_Shifters.SchDoc
size A3
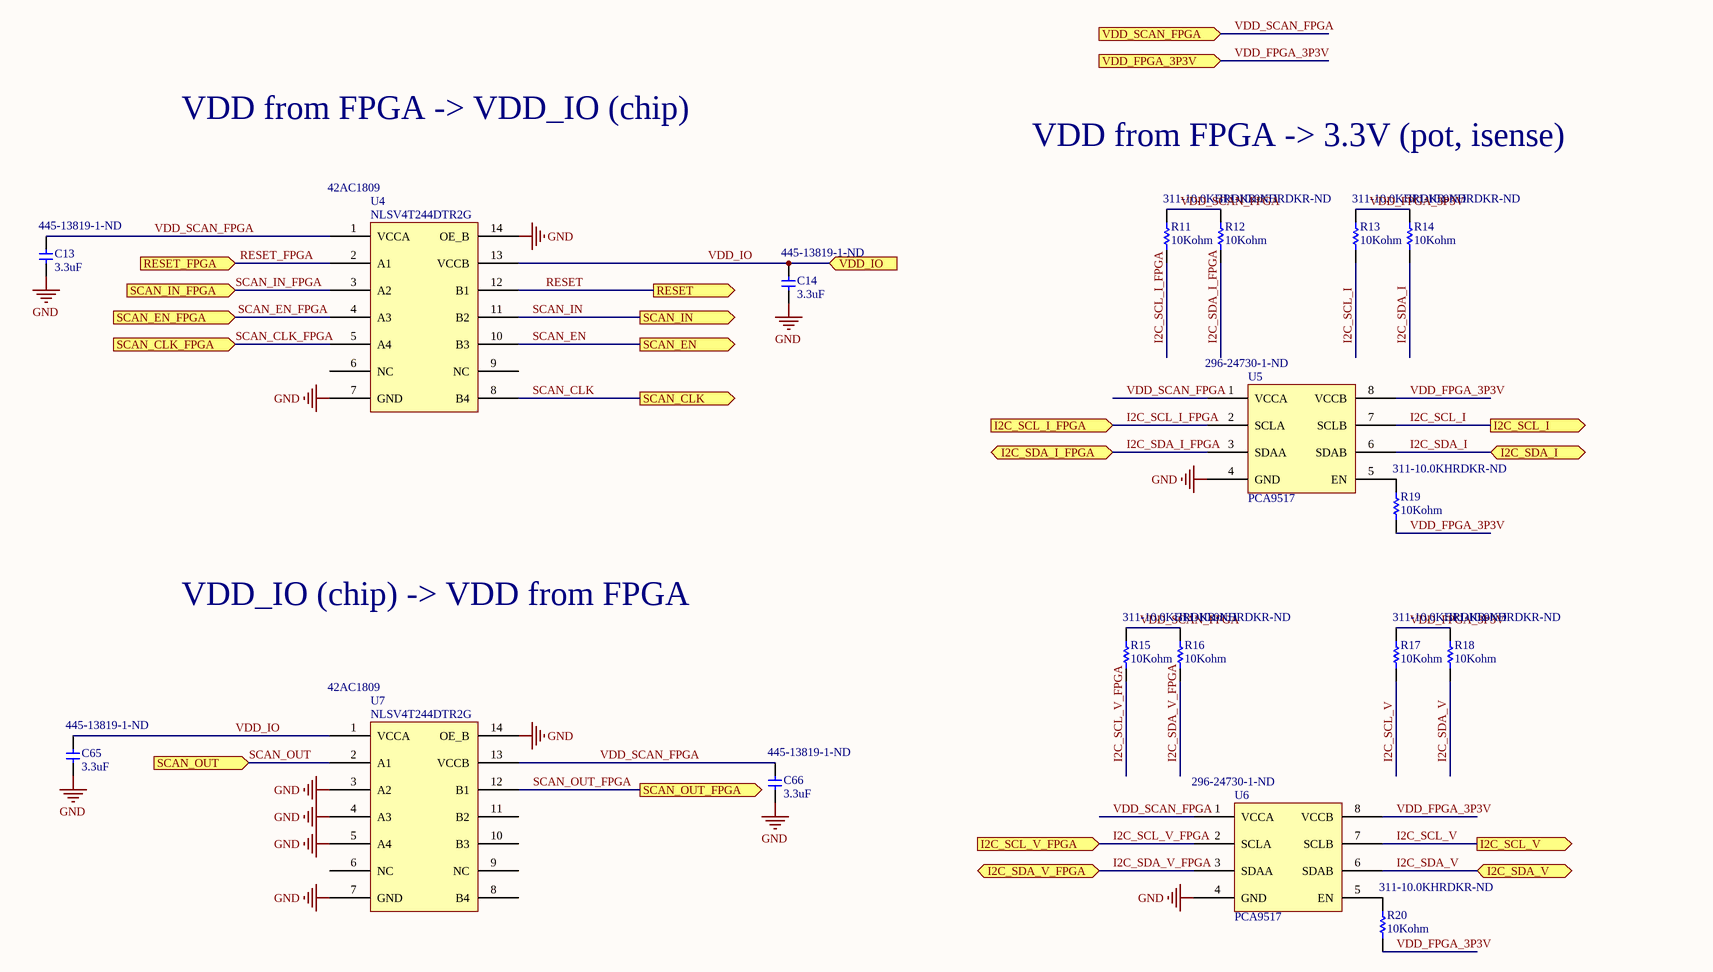
[diagram p5: Lvl_Shifters.SchDoc]

### Parts
C13  3.3uF  Supplier Part Number 1: 445-13819-1-ND  [CAP_0402]
C14  3.3uF  Supplier Part Number 1: 445-13819-1-ND  [CAP_0402]
C65  3.3uF  Supplier Part Number 1: 445-13819-1-ND  [CAP_0402]
C66  3.3uF  Supplier Part Number 1: 445-13819-1-ND  [CAP_0402]
R11  10Kohm  Supplier Part Number 1: 311-10.0KHRDKR-ND  [RES_0603]
R12  10Kohm  Supplier Part Number 1: 311-10.0KHRDKR-ND  [RES_0603]
R13  10Kohm  Supplier Part Number 1: 311-10.0KHRDKR-ND  [RES_0603]
R14  10Kohm  Supplier Part Number 1: 311-10.0KHRDKR-ND  [RES_0603]
R15  10Kohm  Supplier Part Number 1: 311-10.0KHRDKR-ND  [RES_0603]
R16  10Kohm  Supplier Part Number 1: 311-10.0KHRDKR-ND  [RES_0603]
R17  10Kohm  Supplier Part Number 1: 311-10.0KHRDKR-ND  [RES_0603]
R18  10Kohm  Supplier Part Number 1: 311-10.0KHRDKR-ND  [RES_0603]
R19  10Kohm  Supplier Part Number 1: 311-10.0KHRDKR-ND  [RES_0603]
R20  10Kohm  Supplier Part Number 1: 311-10.0KHRDKR-ND  [RES_0603]
U4  NLSV4T244DTR2G  Supplier Part Number 1: 42AC1809  [948G-01]
U5  PCA9517  Supplier Part Number 1: 296-24730-1-ND  [PCA9517]
U6  PCA9517  Supplier Part Number 1: 296-24730-1-ND  [PCA9517]
U7  NLSV4T244DTR2G  Supplier Part Number 1: 42AC1809  [948G-01]

### Ports
I2C_SCL_I (out), I2C_SCL_I_FPGA (in), I2C_SCL_V (out), I2C_SCL_V_FPGA (in), I2C_SDA_I (bidir), I2C_SDA_I_FPGA (bidir), I2C_SDA_V (bidir), I2C_SDA_V_FPGA (bidir), RESET (out), RESET_FPGA (in), SCAN_CLK (out), SCAN_CLK_FPGA (in), SCAN_EN (out), SCAN_EN_FPGA (in), SCAN_IN (out), SCAN_IN_FPGA (in), SCAN_OUT (in), SCAN_OUT_FPGA (out), VDD_FPGA_3P3V (in), VDD_IO (in), VDD_SCAN_FPGA (in)

### Nets
GND: C13.2 C14.2 C65.2 C66.2 U4.7(GND) U4.14(OE_B) U5.4(GND) U6.4(GND) U7.3(A2) U7.4(A3) U7.5(A4) U7.7(GND) U7.14(OE_B)
I2C_SCL_I: R13.2(BOT) U5.7(SCLB) ; port I2C_SCL_I
I2C_SCL_I_FPGA: R11.2(BOT) U5.2(SCLA) ; port I2C_SCL_I_FPGA
I2C_SCL_V: R17.2(BOT) U6.7(SCLB) ; port I2C_SCL_V
I2C_SCL_V_FPGA: R15.2(BOT) U6.2(SCLA) ; port I2C_SCL_V_FPGA
I2C_SDA_I: R14.2(BOT) U5.6(SDAB) ; port I2C_SDA_I
I2C_SDA_I_FPGA: R12.2(BOT) U5.3(SDAA) ; port I2C_SDA_I_FPGA
I2C_SDA_V: R18.2(BOT) U6.6(SDAB) ; port I2C_SDA_V
I2C_SDA_V_FPGA: R16.2(BOT) U6.3(SDAA) ; port I2C_SDA_V_FPGA
RESET: U4.12(B1) ; port RESET
RESET_FPGA: U4.2(A1) ; port RESET_FPGA
SCAN_CLK: U4.8(B4) ; port SCAN_CLK
SCAN_CLK_FPGA: U4.5(A4) ; port SCAN_CLK_FPGA
SCAN_EN: U4.10(B3) ; port SCAN_EN
SCAN_EN_FPGA: U4.4(A3) ; port SCAN_EN_FPGA
SCAN_IN: U4.11(B2) ; port SCAN_IN
SCAN_IN_FPGA: U4.3(A2) ; port SCAN_IN_FPGA
SCAN_OUT: U7.2(A1) ; port SCAN_OUT
SCAN_OUT_FPGA: U7.12(B1) ; port SCAN_OUT_FPGA
VDD_FPGA_3P3V: R13.1(TOP) R14.1(TOP) R17.1(TOP) R18.1(TOP) R19.2(BOT) R20.2(BOT) U5.8(VCCB) U6.8(VCCB) ; port VDD_FPGA_3P3V
VDD_IO: C14.1 C65.1 U4.13(VCCB) U7.1(VCCA) ; port VDD_IO
VDD_SCAN_FPGA: C13.1 C66.1 R11.1(TOP) R12.1(TOP) R15.1(TOP) R16.1(TOP) U4.1(VCCA) U5.1(VCCA) U6.1(VCCA) U7.13(VCCB) ; port VDD_SCAN_FPGA
NetR19_1: R19.1(TOP) U5.5(EN)
NetR20_1: R20.1(TOP) U6.5(EN)

Not connected (* = marked no-connect by the designer): U4 6(NC) 9(NC); U7 6(NC) 8(B4) 9(NC) 10(B3) 11(B2)

### Notes on the sheet
- VDD from FPGA -> VDD_IO (chip)
- VDD from FPGA -> 3.3V (pot, isense)
- VDD_IO (chip) -> VDD from FPGA

### Library data of the parts
C13 C14 C65 C66 = cap 3p3uF: as C99 on sheet SMA_RF_CLK; Digikey ID: 445-13819-1-ND; Value: 3.3uF; Package: 0402; Supplier 1: Digi-Key
R11-R20 = res 10 kOhm_1: RES SMD 10k OHM 1% 1/10W 0603; Package: 0603; Supplier 1: Digi-Key; Supplier 2: Digi-Key; Supplier Part Number 2: 541-10.0KHCT-ND
U4 U7 = NLSV4T244: Voltage Level Translator Unidirectional 1 Circuit 4 Channel 14-TSSOP; Manufacturer: ON Semiconductor; Voltage Range: 0.9V-4.5V; Num. Channels: 4; Manufacturer ID: NLSV4T244DTR2G; Digikey ID: NLSV4T244DTR2GOSCT-ND; Package: TSSOP−14; Supplier 1: Newark
U5 U6 = PCA9517: I2C Repeater, Buffer, ReDriver 2 Channel 400kHz 8-VSSOP; Manufacturer: TI; Manufacturer ID: PCA9517DGKR; Voltage Range B: 2.7V-5.5V; Voltage Range A: 0.9V-5.5V; Digikey ID: 296-24730-1-ND; Package: 8-VSSOP; Supplier 1: Digi-Key

## Sheet Supplies.SchDoc
size 127 x 254 mm
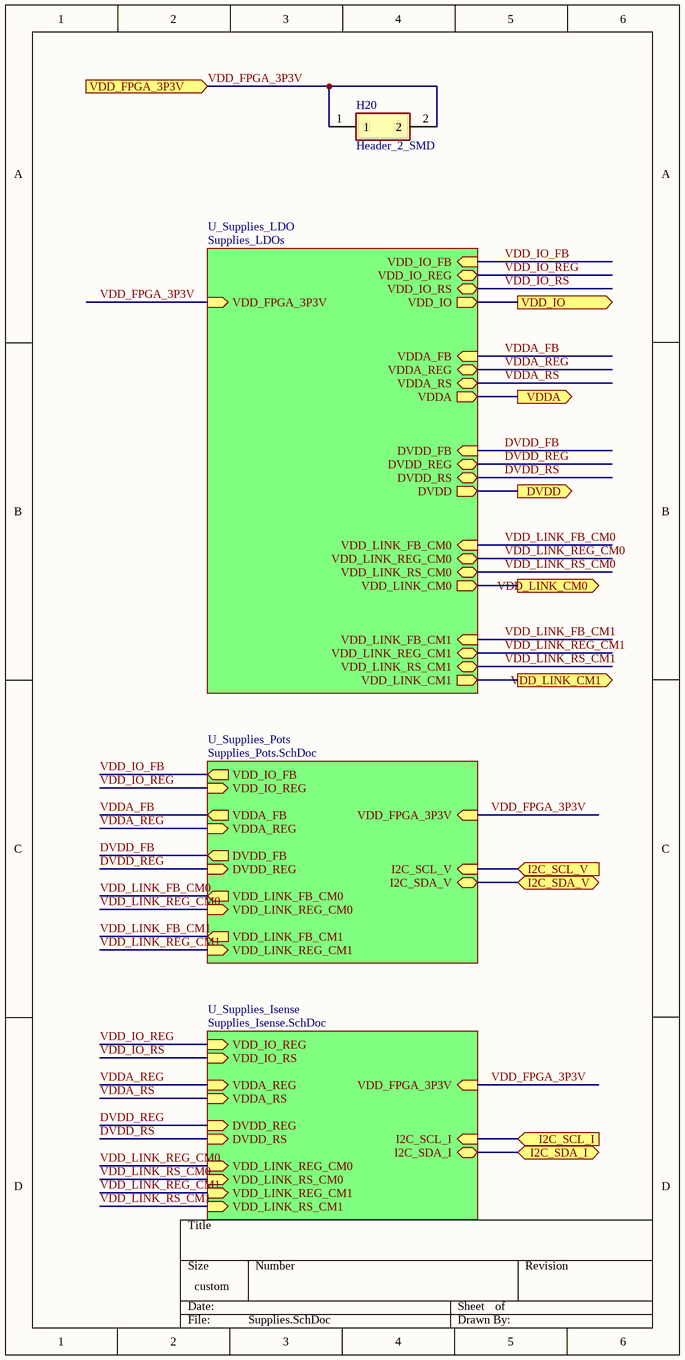
[diagram p6: Supplies.SchDoc]

### Parts
H20  Header_2_SMD  [HDR1X2_SMD_S]

### Sub-sheets
U_Supplies_Isense = Supplies_Isense.SchDoc: I2C_SDA_I (bidir), VDD_IO_REG (in), DVDD_REG (in), VDD_FPGA_3P3V (in), VDDA_RS (in), DVDD_RS (in), VDDA_REG (in), I2C_SCL_I (in), VDD_IO_RS (in), VDD_LINK_RS_CM1 (in), VDD_LINK_REG_CM1 (in), VDD_LINK_REG_CM0 (in), VDD_LINK_RS_CM0 (in)
U_Supplies_LDO = Supplies_LDOs: VDD_IO_FB (in), DVDD_FB (in), VDD_IO_RS (bidir), DVDD (out), VDDA_RS (bidir), VDDA (out), VDD_IO_REG (bidir), DVDD_RS (bidir), VDDA_FB (in), VDDA_REG (bidir), DVDD_REG (bidir), VDD_IO (out), VDD_FPGA_3P3V (in), VDD_LINK_RS_CM1 (bidir), VDD_LINK_FB_CM0 (in), VDD_LINK_CM1 (out), VDD_LINK_CM0 (out), VDD_LINK_REG_CM0 (bidir), VDD_LINK_REG_CM1 (bidir), VDD_LINK_FB_CM1 (in), VDD_LINK_RS_CM0 (bidir)
U_Supplies_Pots = Supplies_Pots.SchDoc: VDD_FPGA_3P3V (in), VDD_IO_REG (in), VDDA_FB (out), DVDD_REG (in), VDDA_REG (in), DVDD_FB (out), VDD_IO_FB (out), I2C_SCL_V (in), I2C_SDA_V (bidir), VDD_LINK_REG_CM1 (in), VDD_LINK_FB_CM0 (out), VDD_LINK_REG_CM0 (in), VDD_LINK_FB_CM1 (out)

### Ports
DVDD (out), I2C_SCL_I (in), I2C_SCL_V (in), I2C_SDA_I (bidir), I2C_SDA_V (bidir), VDD_FPGA_3P3V (in), VDD_IO (out), VDD_LINK_CM0 (out), VDD_LINK_CM1 (out), VDDA (out)

### Nets
DVDD: port DVDD, sheet U_Supplies_LDO/DVDD
DVDD_FB: sheet U_Supplies_LDO/DVDD_FB, sheet U_Supplies_Pots/DVDD_FB
DVDD_REG: sheet U_Supplies_LDO/DVDD_REG, sheet U_Supplies_Isense/DVDD_REG, sheet U_Supplies_Pots/DVDD_REG
DVDD_RS: sheet U_Supplies_LDO/DVDD_RS, sheet U_Supplies_Isense/DVDD_RS
I2C_SCL_I: port I2C_SCL_I, sheet U_Supplies_Isense/I2C_SCL_I
I2C_SCL_V: port I2C_SCL_V, sheet U_Supplies_Pots/I2C_SCL_V
I2C_SDA_I: port I2C_SDA_I, sheet U_Supplies_Isense/I2C_SDA_I
I2C_SDA_V: port I2C_SDA_V, sheet U_Supplies_Pots/I2C_SDA_V
VDD_FPGA_3P3V: H20.1 H20.2 ; port VDD_FPGA_3P3V, sheet U_Supplies_LDO/VDD_FPGA_3P3V, sheet U_Supplies_Isense/VDD_FPGA_3P3V, sheet U_Supplies_Pots/VDD_FPGA_3P3V
VDD_IO: port VDD_IO, sheet U_Supplies_LDO/VDD_IO
VDD_IO_FB: sheet U_Supplies_LDO/VDD_IO_FB, sheet U_Supplies_Pots/VDD_IO_FB
VDD_IO_REG: sheet U_Supplies_LDO/VDD_IO_REG, sheet U_Supplies_Isense/VDD_IO_REG, sheet U_Supplies_Pots/VDD_IO_REG
VDD_IO_RS: sheet U_Supplies_LDO/VDD_IO_RS, sheet U_Supplies_Isense/VDD_IO_RS
VDD_LINK_CM0: port VDD_LINK_CM0, sheet U_Supplies_LDO/VDD_LINK_CM0
VDD_LINK_CM1: port VDD_LINK_CM1, sheet U_Supplies_LDO/VDD_LINK_CM1
VDD_LINK_FB_CM0: sheet U_Supplies_LDO/VDD_LINK_FB_CM0, sheet U_Supplies_Pots/VDD_LINK_FB_CM0  [project net VDD_LINK_FB]
VDD_LINK_FB_CM1: sheet U_Supplies_LDO/VDD_LINK_FB_CM1, sheet U_Supplies_Pots/VDD_LINK_FB_CM1
VDD_LINK_REG_CM0: sheet U_Supplies_LDO/VDD_LINK_REG_CM0, sheet U_Supplies_Isense/VDD_LINK_REG_CM0, sheet U_Supplies_Pots/VDD_LINK_REG_CM0
VDD_LINK_REG_CM1: sheet U_Supplies_LDO/VDD_LINK_REG_CM1, sheet U_Supplies_Isense/VDD_LINK_REG_CM1, sheet U_Supplies_Pots/VDD_LINK_REG_CM1
VDD_LINK_RS_CM0: sheet U_Supplies_LDO/VDD_LINK_RS_CM0, sheet U_Supplies_Isense/VDD_LINK_RS_CM0
VDD_LINK_RS_CM1: sheet U_Supplies_LDO/VDD_LINK_RS_CM1, sheet U_Supplies_Isense/VDD_LINK_RS_CM1
VDDA: port VDDA, sheet U_Supplies_LDO/VDDA
VDDA_FB: sheet U_Supplies_LDO/VDDA_FB, sheet U_Supplies_Pots/VDDA_FB
VDDA_REG: sheet U_Supplies_LDO/VDDA_REG, sheet U_Supplies_Isense/VDDA_REG, sheet U_Supplies_Pots/VDDA_REG
VDDA_RS: sheet U_Supplies_LDO/VDDA_RS, sheet U_Supplies_Isense/VDDA_RS

### Library data of the parts
H20 = Header_2_SMD: as H15 on sheet Top; Datasheet Link: https://componentsearchengine.com/Datasheets/2/TSM-102-01-S-SV.pdf; Arrow Part Number: TSM-102-01-S-SV; Arrow Price/Stock: https://www.arrow.com/en/products/tsm-102-01-s-sv/samtec; Mouser Part Number: 200-TSM10201SSV; Mouser Price/Stock: https://www.mouser.co.uk/ProductDetail/Samtec/TSM-102-01-S-SV?qs=FESYatJ8odJNSemiJZ%2Fyzw%3D%3D; Supplier 1: Digi-Key; Supplier Part Number 1: SAM10783-ND

## Sheet Supplies_LDOs.SchDoc
size 406 x 406 mm
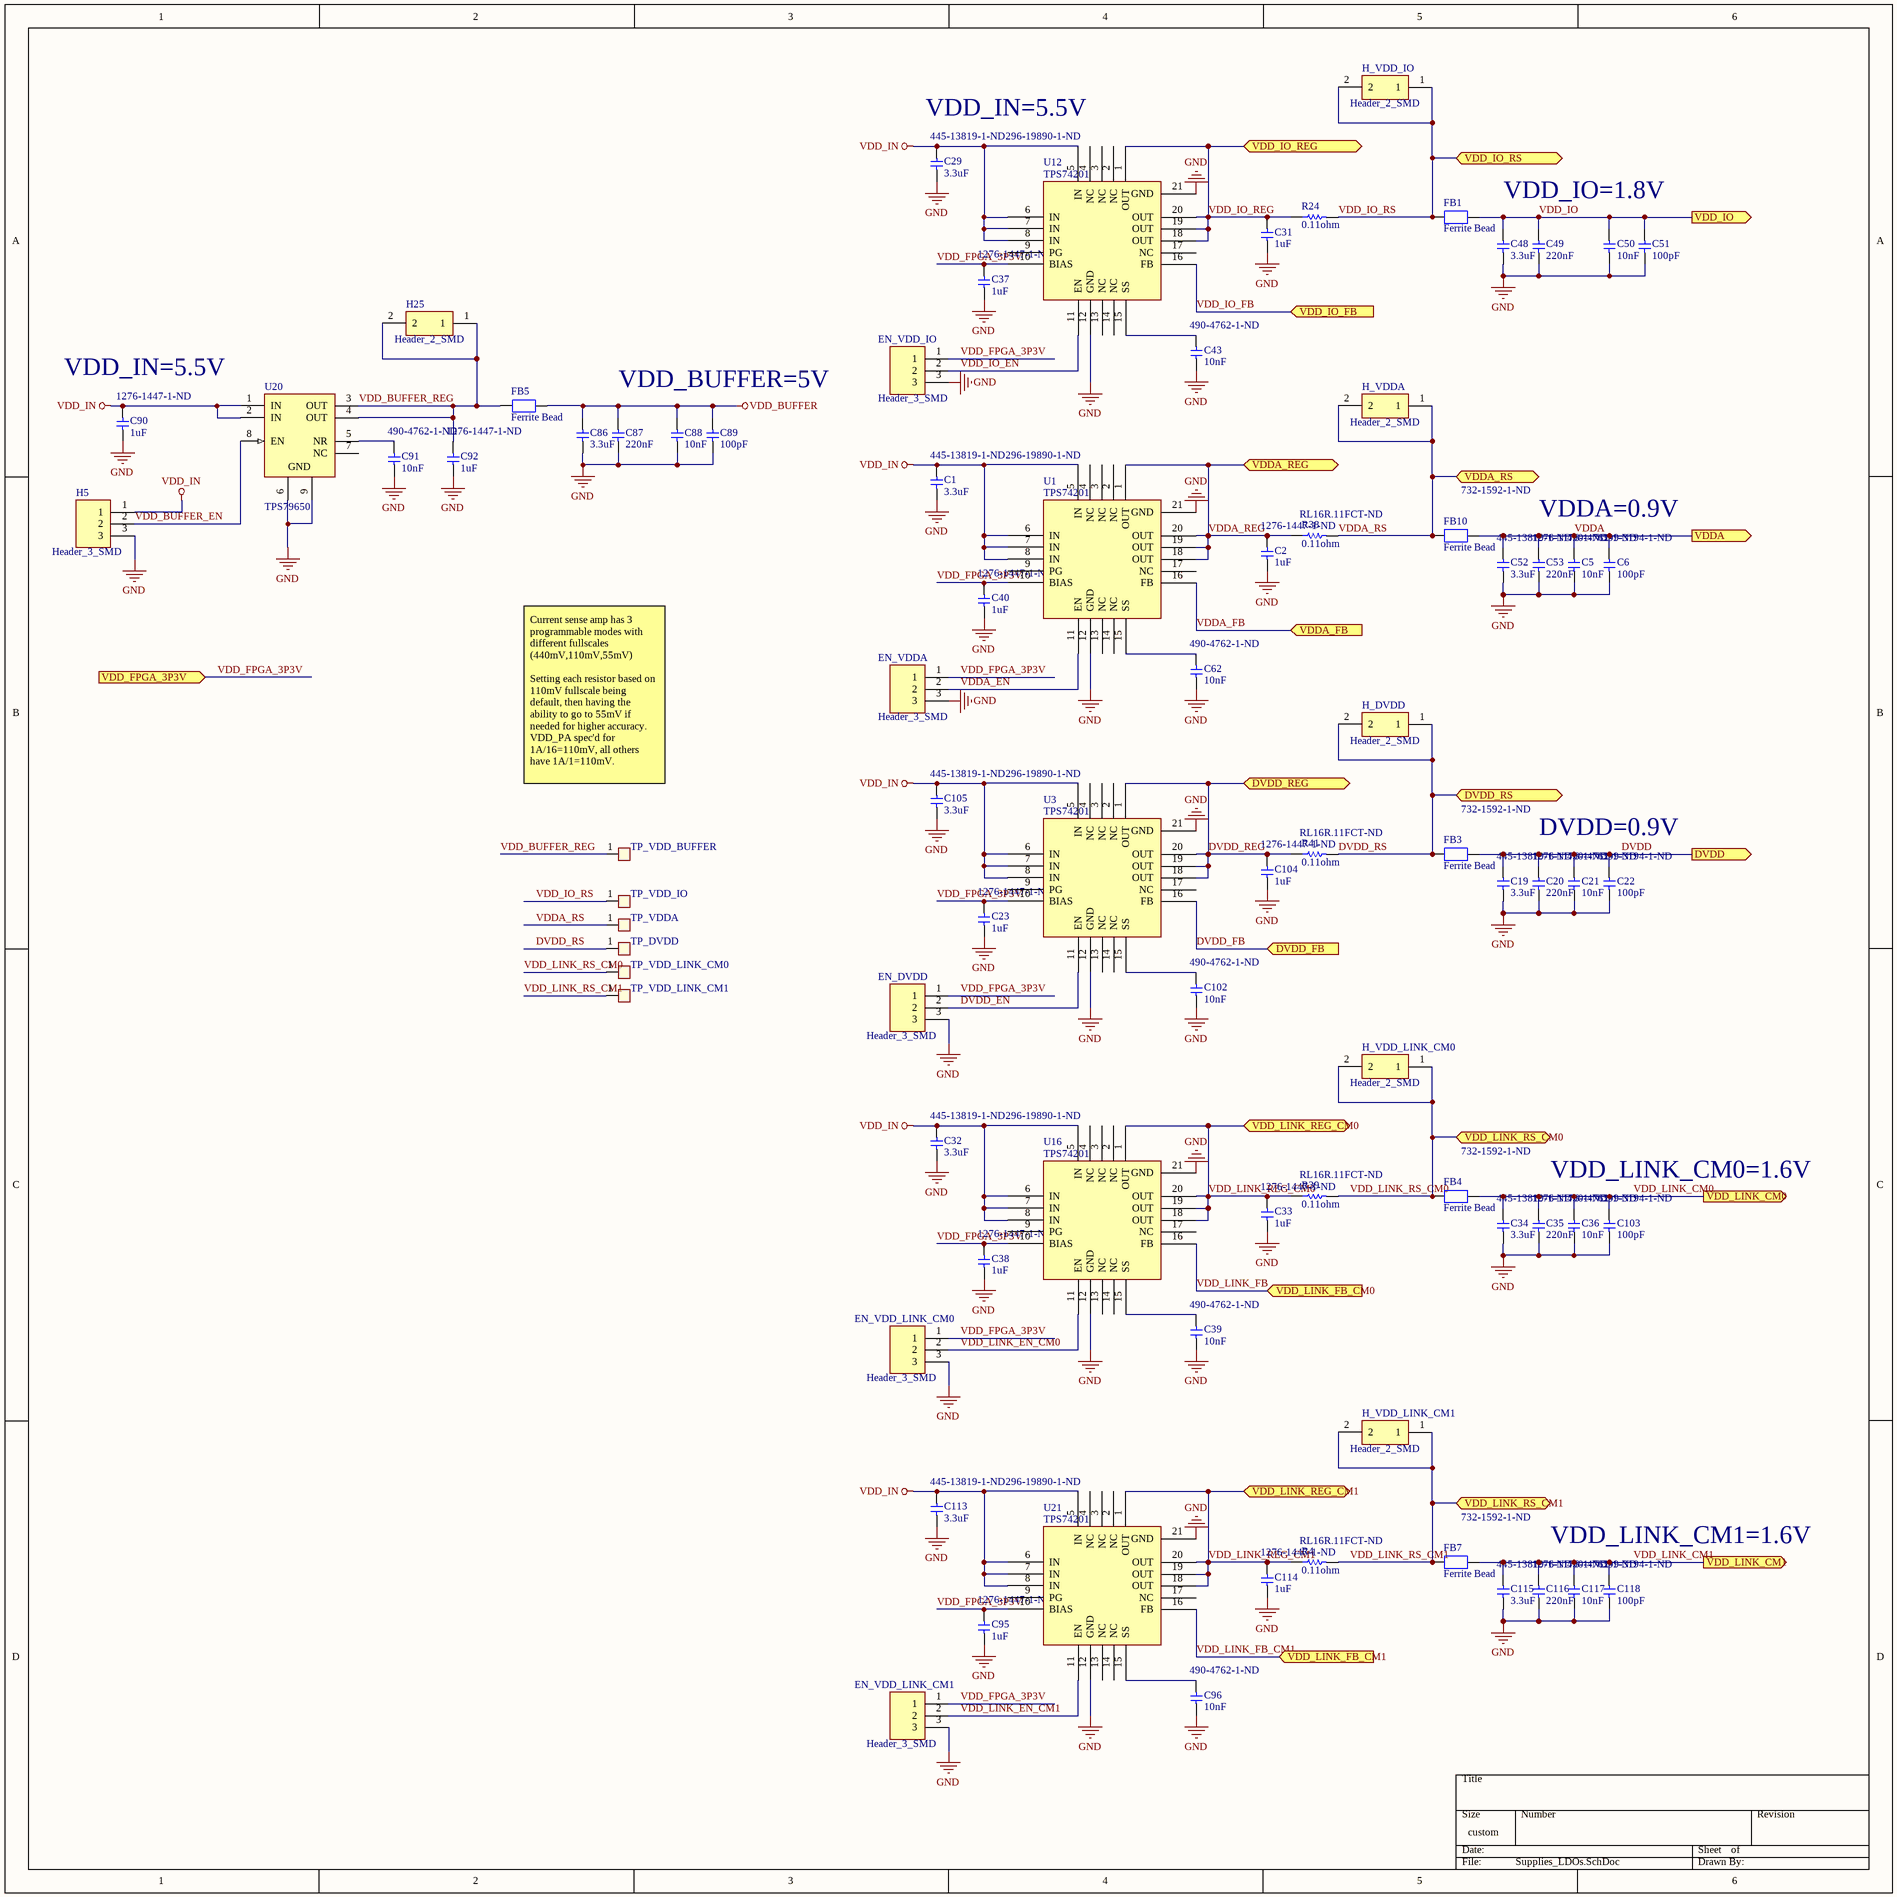
[diagram p7: Supplies_LDOs.SchDoc]

### Parts
C1  3.3uF  Supplier Part Number 1: 445-13819-1-ND  [CAP_0402]
C2  1uF  Supplier Part Number 1: 1276-1447-1-ND  [CAP_0402]
C5  10nF  Supplier Part Number 1: 490-4762-1-ND  [CAPC1005X06L_HD]
C6  100pF  Supplier Part Number 1: 399-3194-1-ND  [CAPC1005X06L_HD]
C19  3.3uF  Supplier Part Number 1: 445-13819-1-ND  [CAP_0402]
C20  220nF  Supplier Part Number 1: 1276-1176-1-ND  [CAP_0402]
C21  10nF  Supplier Part Number 1: 490-4762-1-ND  [CAPC1005X06L_HD]
C22  100pF  Supplier Part Number 1: 399-3194-1-ND  [CAPC1005X06L_HD]
C23  1uF  Supplier Part Number 1: 1276-1447-1-ND  [CAP_0402]
C29  3.3uF  Supplier Part Number 1: 445-13819-1-ND  [CAP_0402]
C31  1uF  [CAP_0402]
C32  3.3uF  Supplier Part Number 1: 445-13819-1-ND  [CAP_0402]
C33  1uF  Supplier Part Number 1: 1276-1447-1-ND  [CAP_0402]
C34  3.3uF  Supplier Part Number 1: 445-13819-1-ND  [CAP_0402]
C35  220nF  Supplier Part Number 1: 1276-1176-1-ND  [CAP_0402]
C36  10nF  Supplier Part Number 1: 490-4762-1-ND  [CAPC1005X06L_HD]
C37  1uF  Supplier Part Number 1: 1276-1447-1-ND  [CAP_0402]
C38  1uF  Supplier Part Number 1: 1276-1447-1-ND  [CAP_0402]
C39  10nF  Supplier Part Number 1: 490-4762-1-ND  [CAPC1005X06L_HD]
C40  1uF  Supplier Part Number 1: 1276-1447-1-ND  [CAP_0402]
C43  10nF  Supplier Part Number 1: 490-4762-1-ND  [CAPC1005X06L_HD]
C48  3.3uF  [CAP_0402]
C49  220nF  [CAP_0402]
C50  10nF  [CAPC1005X06L_HD]
C51  100pF  [CAPC1005X06L_HD]
C52  3.3uF  Supplier Part Number 1: 445-13819-1-ND  [CAP_0402]
C53  220nF  Supplier Part Number 1: 1276-1176-1-ND  [CAP_0402]
C62  10nF  Supplier Part Number 1: 490-4762-1-ND  [CAPC1005X06L_HD]
C86  3.3uF  [CAP_0402]
C87  220nF  [CAP_0402]
C88  10nF  [CAPC1005X06L_HD]
C89  100pF  [CAPC1005X06L_HD]
C90  1uF  Supplier Part Number 1: 1276-1447-1-ND  [CAP_0402]
C91  10nF  Supplier Part Number 1: 490-4762-1-ND  [CAPC1005X06L_HD]
C92  1uF  Supplier Part Number 1: 1276-1447-1-ND  [CAP_0402]
C95  1uF  Supplier Part Number 1: 1276-1447-1-ND  [CAP_0402]
C96  10nF  Supplier Part Number 1: 490-4762-1-ND  [CAPC1005X06L_HD]
C102  10nF  Supplier Part Number 1: 490-4762-1-ND  [CAPC1005X06L_HD]
C103  100pF  Supplier Part Number 1: 399-3194-1-ND  [CAPC1005X06L_HD]
C104  1uF  Supplier Part Number 1: 1276-1447-1-ND  [CAP_0402]
C105  3.3uF  Supplier Part Number 1: 445-13819-1-ND  [CAP_0402]
C113  3.3uF  Supplier Part Number 1: 445-13819-1-ND  [CAP_0402]
C114  1uF  Supplier Part Number 1: 1276-1447-1-ND  [CAP_0402]
C115  3.3uF  Supplier Part Number 1: 445-13819-1-ND  [CAP_0402]
C116  220nF  Supplier Part Number 1: 1276-1176-1-ND  [CAP_0402]
C117  10nF  Supplier Part Number 1: 490-4762-1-ND  [CAPC1005X06L_HD]
C118  100pF  Supplier Part Number 1: 399-3194-1-ND  [CAPC1005X06L_HD]
EN_DVDD  Header_3_SMD  [HDR1X3_SMD]
EN_VDD_IO  Header_3_SMD  [HDR1X3_SMD]
EN_VDD_LINK_CM0  Header_3_SMD  [HDR1X3_SMD]
EN_VDD_LINK_CM1  Header_3_SMD  [HDR1X3_SMD]
EN_VDDA  Header_3_SMD  [HDR1X3_SMD]
FB1  Ferrite Bead  [FER_SMD-0603]
FB3  Ferrite Bead  Supplier Part Number 1: 732-1592-1-ND  [FER_SMD-0603]
FB4  Ferrite Bead  Supplier Part Number 1: 732-1592-1-ND  [FER_SMD-0603]
FB5  Ferrite Bead  [FER_SMD-0603]
FB7  Ferrite Bead  Supplier Part Number 1: 732-1592-1-ND  [FER_SMD-0603]
FB10  Ferrite Bead  Supplier Part Number 1: 732-1592-1-ND  [FER_SMD-0603]
H5  Header_3_SMD  [HDR1X3_SMD]
H25  Header_2_SMD  [HDR1X2_SMD_S]
H_DVDD  Header_2_SMD  [HDR1X2_SMD_S]
H_VDD_IO  Header_2_SMD  [HDR1X2_SMD_S]
H_VDD_LINK_CM0  Header_2_SMD  [HDR1X2_SMD_S]
H_VDD_LINK_CM1  Header_2_SMD  [HDR1X2_SMD_S]
H_VDDA  Header_2_SMD  [HDR1X2_SMD_S]
R4  0.11ohm  Supplier Part Number 1: RL16R.11FCT-ND  [RES_1206]
R24  0.11ohm  [RES_1206]
R38  0.11ohm  Supplier Part Number 1: RL16R.11FCT-ND  [RES_1206]
R39  0.11ohm  Supplier Part Number 1: RL16R.11FCT-ND  [RES_1206]
R41  0.11ohm  Supplier Part Number 1: RL16R.11FCT-ND  [RES_1206]
TP_DVDD  TestPoint_SMD  [TestPoint_SMD]  (value not drawn)
TP_VDD_BUFFER  TestPoint_SMD  [TestPoint_SMD]  (value not drawn)
TP_VDD_IO  TestPoint_SMD  [TestPoint_SMD]  (value not drawn)
TP_VDD_LINK_CM0  TestPoint_SMD  [TestPoint_SMD]  (value not drawn)
TP_VDD_LINK_CM1  TestPoint_SMD  [TestPoint_SMD]  (value not drawn)
TP_VDDA  TestPoint_SMD  [TestPoint_SMD]  (value not drawn)
U1  TPS74201  Supplier Part Number 1: 296-19890-1-ND  [TPS74201_NPV]
U3  TPS74201  Supplier Part Number 1: 296-19890-1-ND  [TPS74201_NPV]
U12  TPS74201  Supplier Part Number 1: 296-19890-1-ND  [TPS74201_NPV]
U16  TPS74201  Supplier Part Number 1: 296-19890-1-ND  [TPS74201_NPV]
U20  TPS79650  [TI-DRB8-2400X1650TP_V]
U21  TPS74201  Supplier Part Number 1: 296-19890-1-ND  [TPS74201_NPV]

### Ports
DVDD (out), DVDD_FB (in), DVDD_REG (bidir), DVDD_RS (bidir), VDD_FPGA_3P3V (in), VDD_IO (out), VDD_IO_FB (in), VDD_IO_REG (bidir), VDD_IO_RS (bidir), VDD_LINK_CM0 (out), VDD_LINK_CM1 (out), VDD_LINK_FB_CM0 (in), VDD_LINK_FB_CM1 (in), VDD_LINK_REG_CM0 (bidir), VDD_LINK_REG_CM1 (bidir), VDD_LINK_RS_CM0 (bidir), VDD_LINK_RS_CM1 (bidir), VDDA (out), VDDA_FB (in), VDDA_REG (bidir), VDDA_RS (bidir)

### Nets
GND: C1.2 C2.2 C5.2 C6.2 C19.2 C20.2 C21.2 C22.2 C23.2 C29.2 C31.2 C32.2 C33.2 C34.2 C35.2 C36.2 C37.2 C38.2 C39.2 C40.2 C43.2 C48.2 C49.2 C50.2 C51.2 C52.2 C53.2 C62.2 C86.2 C87.2 C88.2 C89.2 C90.2 C91.2 C92.2 C95.2 C96.2 C102.2 C103.2 C104.2 C105.2 C113.2 C114.2 C115.2 C116.2 C117.2 C118.2 EN_DVDD.3 EN_VDD_IO.3 EN_VDD_LINK_CM0.3 EN_VDD_LINK_CM1.3 EN_VDDA.3 H5.3 U1.12(GND) U1.21(GND) U3.12(GND) U3.21(GND) U12.12(GND) U12.21(GND) U16.12(GND) U16.21(GND) U20.6(GND) U20.9(GND) U21.12(GND) U21.21(GND)
VDD_BUFFER: C86.1 C87.1 C88.1 C89.1 FB5.2
VDD_IN: C1.1 C29.1 C32.1 C90.1 C105.1 C113.1 H5.1 U1.5(IN) U1.6(IN) U1.7(IN) U1.8(IN) U3.5(IN) U3.6(IN) U3.7(IN) U3.8(IN) U12.5(IN) U12.6(IN) U12.7(IN) U12.8(IN) U16.5(IN) U16.6(IN) U16.7(IN) U16.8(IN) U20.1(IN) U20.2(IN) U21.5(IN) U21.6(IN) U21.7(IN) U21.8(IN)
DVDD: C19.1 C20.1 C21.1 C22.1 FB3.2 ; port DVDD
DVDD_EN: EN_DVDD.2 U3.11(EN)
DVDD_FB: U3.16(FB) ; port DVDD_FB
DVDD_REG: C104.1 R41.1(TOP) U3.1(OUT) U3.18(OUT) U3.19(OUT) U3.20(OUT) ; port DVDD_REG
DVDD_RS: FB3.1 H_DVDD.1 H_DVDD.2 R41.2(BOT) TP_DVDD.1(TP) ; port DVDD_RS
VDD_BUFFER_EN: H5.2 U20.8(EN)
VDD_BUFFER_REG: C92.1 FB5.1 H25.1 H25.2 TP_VDD_BUFFER.1(TP) U20.3(OUT) U20.4(OUT)
VDD_FPGA_3P3V: C23.1 C37.1 C38.1 C40.1 C95.1 EN_DVDD.1 EN_VDD_IO.1 EN_VDD_LINK_CM0.1 EN_VDD_LINK_CM1.1 EN_VDDA.1 U1.10(BIAS) U3.10(BIAS) U12.10(BIAS) U16.10(BIAS) U21.10(BIAS) ; port VDD_FPGA_3P3V
VDD_IO: C48.1 C49.1 C50.1 C51.1 FB1.2 ; port VDD_IO
VDD_IO_EN: EN_VDD_IO.2 U12.11(EN)
VDD_IO_FB: U12.16(FB) ; port VDD_IO_FB
VDD_IO_REG: C31.1 R24.1(TOP) U12.1(OUT) U12.18(OUT) U12.19(OUT) U12.20(OUT) ; port VDD_IO_REG
VDD_IO_RS: FB1.1 H_VDD_IO.1 H_VDD_IO.2 R24.2(BOT) TP_VDD_IO.1(TP) ; port VDD_IO_RS
VDD_LINK_CM0: C34.1 C35.1 C36.1 C103.1 FB4.2 ; port VDD_LINK_CM0
VDD_LINK_CM1: C115.1 C116.1 C117.1 C118.1 FB7.2 ; port VDD_LINK_CM1
VDD_LINK_EN_CM0: EN_VDD_LINK_CM0.2 U16.11(EN)
VDD_LINK_EN_CM1: EN_VDD_LINK_CM1.2 U21.11(EN)
VDD_LINK_FB: U16.16(FB) ; port VDD_LINK_FB_CM0
VDD_LINK_FB_CM1: U21.16(FB) ; port VDD_LINK_FB_CM1
VDD_LINK_REG_CM0: C33.1 R39.1(TOP) U16.1(OUT) U16.18(OUT) U16.19(OUT) U16.20(OUT) ; port VDD_LINK_REG_CM0
VDD_LINK_REG_CM1: C114.1 R4.1(TOP) U21.1(OUT) U21.18(OUT) U21.19(OUT) U21.20(OUT) ; port VDD_LINK_REG_CM1
VDD_LINK_RS_CM0: FB4.1 H_VDD_LINK_CM0.1 H_VDD_LINK_CM0.2 R39.2(BOT) TP_VDD_LINK_CM0.1(TP) ; port VDD_LINK_RS_CM0
VDD_LINK_RS_CM1: FB7.1 H_VDD_LINK_CM1.1 H_VDD_LINK_CM1.2 R4.2(BOT) TP_VDD_LINK_CM1.1(TP) ; port VDD_LINK_RS_CM1
VDDA: C5.1 C6.1 C52.1 C53.1 FB10.2 ; port VDDA
VDDA_EN: EN_VDDA.2 U1.11(EN)
VDDA_FB: U1.16(FB) ; port VDDA_FB
VDDA_REG: C2.1 R38.1(TOP) U1.1(OUT) U1.18(OUT) U1.19(OUT) U1.20(OUT) ; port VDDA_REG
VDDA_RS: FB10.1 H_VDDA.1 H_VDDA.2 R38.2(BOT) TP_VDDA.1(TP) ; port VDDA_RS
NetC39_1: C39.1 U16.15(SS)
NetC43_1: C43.1 U12.15(SS)
NetC62_1: C62.1 U1.15(SS)
NetC91_1: C91.1 U20.5(NR)
NetC96_1: C96.1 U21.15(SS)
NetC102_1: C102.1 U3.15(SS)

Not connected (* = marked no-connect by the designer): U1 2(NC) 3(NC) 4(NC) 9(PG) 13(NC) 14(NC) 17(NC); U3 2(NC) 3(NC) 4(NC) 9(PG) 13(NC) 14(NC) 17(NC); U12 2(NC) 3(NC) 4(NC) 9(PG) 13(NC) 14(NC) 17(NC); U16 2(NC) 3(NC) 4(NC) 9(PG) 13(NC) 14(NC) 17(NC); U20 7(NC); U21 2(NC) 3(NC) 4(NC) 9(PG) 13(NC) 14(NC) 17(NC)

### Notes on the sheet
- (near C29) VDD_IN=5.5V
- VDD_IO=1.8V
- (near C90) VDD_IN=5.5V
- VDD_BUFFER=5V
- VDDA=0.9V
- Current sense amp has 3 programmable modes with different fullscales (440mV,110mV,55mV)
  Setting each resistor based on 110mV fullscale being default, then having the ability to go to 55mV if needed for higher accuracy. VDD_PA spec'd for 1A/16=110mV, all others have 1A/1=110mV.
- DVDD=0.9V
- VDD_LINK_CM0=1.6V
- VDD_LINK_CM1=1.6V

### Library data of the parts
C1 C19 C29 C32 C34 C48 C52 C86 C105 C113 C115 = cap 3p3uF: as C99 on sheet SMA_RF_CLK; Digikey ID: 445-13819-1-ND; Value: 3.3uF; Package: 0402; Supplier 1: Digi-Key
  C48 C86: Supplier Part Number 1: 445-13819-1-ND
C2 C23 C31 C33 C37 C38 C40 C90 C92 C95 C104 C114 = cap 1uF 0402: CAP CER 1uF 20% 16V X5R 0402; Manufacturer: Samsung Electro-Mechanics; Manufacturer ID: CL05A105MO5NNNC; Digikey ID: 1276-1447-1-ND; Value: 1uF; Package: 0402; Supplier 1: Digi-Key
  C31: Supplier Part Number 1: 1276-1447-1-ND
C5 C21 C36 C39 C43 C50 C62 C88 C91 C96 C102 C117 = cap 10nF: as C98 on sheet SMA_RF_CLK; Digikey ID: 490-4762-1-ND; Package: 0402; Supplier 1: Digi-Key
  C50 C88: Supplier Part Number 1: 490-4762-1-ND
C6 C22 C51 C89 C103 C118 = cap 100pF 0402: as C100 on sheet SMA_RF_CLK; Digikey ID: 399-3194-1-ND; Value: 100pF; Package: 0402; Supplier 1: Digi-Key
  C51 C89: Supplier Part Number 1: 399-3194-1-ND
C20 C35 C49 C53 C87 C116 = cap 220nF: as C30 on sheet SMA_RF_CLK; Digikey ID: 1276-1176-1-ND; Value: 0.22uF; Package: 0402; Supplier 1: Digi-Key
  C49 C87: Supplier Part Number 1: 1276-1176-1-ND
EN_DVDD EN_VDD_IO EN_VDD_LINK_CM0 EN_VDD_LINK_CM1 EN_VDDA H5 = Header_3_SMD: as H16 on sheet Top; Datasheet Link: http://suddendocs.samtec.com/prints/tsm-1xx-xx-xxx-sv-xx-xxx-xx-mkt.pdf; Height: 11.17mm; Arrow Part Number: TSM-103-01-S-SV-P-TR; Arrow Price/Stock: https://www.arrow.com/en/products/tsm-103-01-s-sv-p-tr/samtec; Mouser Part Number: 200-TSM10301SSVPTR; Mouser Price/Stock: https://www.mouser.co.uk/ProductDetail/Samtec/TSM-103-01-S-SV-P-TR?qs=FESYatJ8odJI6Ns4akqicQ%3D%3D; Supplier 1: Newark; Supplier 2: Digi-Key; Supplier Part Number 1: 80K8300; Supplier Part Number 2: SAM13283CT-ND
FB1 FB3-FB5 FB7 FB10 = Ferrite Bead: Ferrite Bead 300 Ohms @ 100MHz 1 Signal Line 0603 (1608 Metric) 2A 150mOhm; Manufacturer: Wurth; Manufacturer ID: 742792641; Impedance: 300 Ohm @ 100MHz; Digikey ID: 732-1592-1-ND; Current Rating: 2A; Package: 0603; Supplier 1: Digi-Key
  FB1 FB5: Supplier Part Number 1: 732-1592-1-ND
H25 H_DVDD H_VDD_IO H_VDD_LINK_CM0 H_VDD_LINK_CM1 H_VDDA = Header_2_SMD: as H15 on sheet Top; Datasheet Link: https://componentsearchengine.com/Datasheets/2/TSM-102-01-S-SV.pdf; Arrow Part Number: TSM-102-01-S-SV; Arrow Price/Stock: https://www.arrow.com/en/products/tsm-102-01-s-sv/samtec; Mouser Part Number: 200-TSM10201SSV; Mouser Price/Stock: https://www.mouser.co.uk/ProductDetail/Samtec/TSM-102-01-S-SV?qs=FESYatJ8odJNSemiJZ%2Fyzw%3D%3D; Supplier 1: Digi-Key; Supplier Part Number 1: SAM10783-ND
R4 R24 R38 R39 R41 = res 0.11 ohm: RES 0.11 OHM 1% 1/2W 1206; Manufacturer: Susumu; Manufacturer ID: RL1632R-R110-F; Digikey ID: RL16R.11FCT-ND; Package: 1206; Supplier 1: Digi-Key
  R24: Supplier Part Number 1: RL16R.11FCT-ND
TP_DVDD TP_VDD_BUFFER TP_VDD_IO TP_VDD_LINK_CM0 TP_VDD_LINK_CM1 TP_VDDA = TestPoint_SMD: Test Point, SMD 1mm x 1.8mm, 1.15mm high.; Supplier 1: Digi-Key; Supplier Part Number 1: 952-2665-1-ND
U1 U3 U12 U16 U21 = TPS74201: Linear Positive Voltage Regulator IC, Adjustable Voltage, 1 Output 1.5A 20-VQFN (5x5); Manufacturer: TI; Manufacturer ID: TPS74201RGWR; Output Voltage: 0.8V-3.6V; Dropout Voltage: 55mV @ 1.5A; Input Voltage: 0.86V-5.5V; Digikey ID: 296-19890-1-ND; Output Current: 1.5A; Supplier 1: Digi-Key
U20 = TPS79650DRBR: Single Output High PSRR LDO, 1 A, Fixed 5 V Output, 2.7 to 5.5 V Input, 8-pin SON (DRB), -40 to 125 degC, Green (RoHS & no Sb/Br); Manufacturer: Texas Instruments; Accuracy(%): 2; Fixed Output Options(V): 5; Iout(Max)(A): 1; Iq(Typ)(mA): 0.26; SubFamily: Single Channel LDO; Vdo(Typ)(mV): 200; Vin(Max)(V): 5.5; Vin(Min)(V): 2.7; DatasheetVersion: SLVS351N; PackageVersion: 4203482-2/K; PackageReference: DRB8-2400X1650TP; PackageDescription: 8-Pin Plastic Small Outline, Body 3 x 3 mm, Pitch 0.65 mm; Supplier 1: Digi-Key; Supplier Part Number 1: 296-21352-2-ND; Supplier 2: Digi-Key; Supplier Part Number 2: 296-21352-1-ND; Supplier 3: Digi-Key; Supplier Part Number 3: 296-21352-6-ND; Supplier 4: Newark; Supplier Part Number 4: 22M1831; Supplier 5: Mouser; Supplier Part Number 5: 595-TPS79650DRBR; Eco-Plan: Green (RoHS & no Sb/Br); Vout Adj(Max)(V): 5; Vout Adj(Min)(V): 5; Mounting Technology: Surface Mount; PartNumber: TPS79650DRBR; ComponentLink1Description: Manufacturer URL; ComponentLink1URL: http://www.ti.com/; ComponentLink2Description: Datasheet; ComponentLink2URL: http://www.ti.com/general/docs/lit/getliterature.tsp?genericPartNumber=TPS79650&fileType=pdf; ComponentLink3Description: Package Specification; ComponentLink3URL: http://www.ti.com/litv/pdf/mpds118h; Digikey ID: 296-21352-1-ND; Manufacturer ID: TPS79650DRBR

## Sheet Supplies_Isense.SchDoc
size A
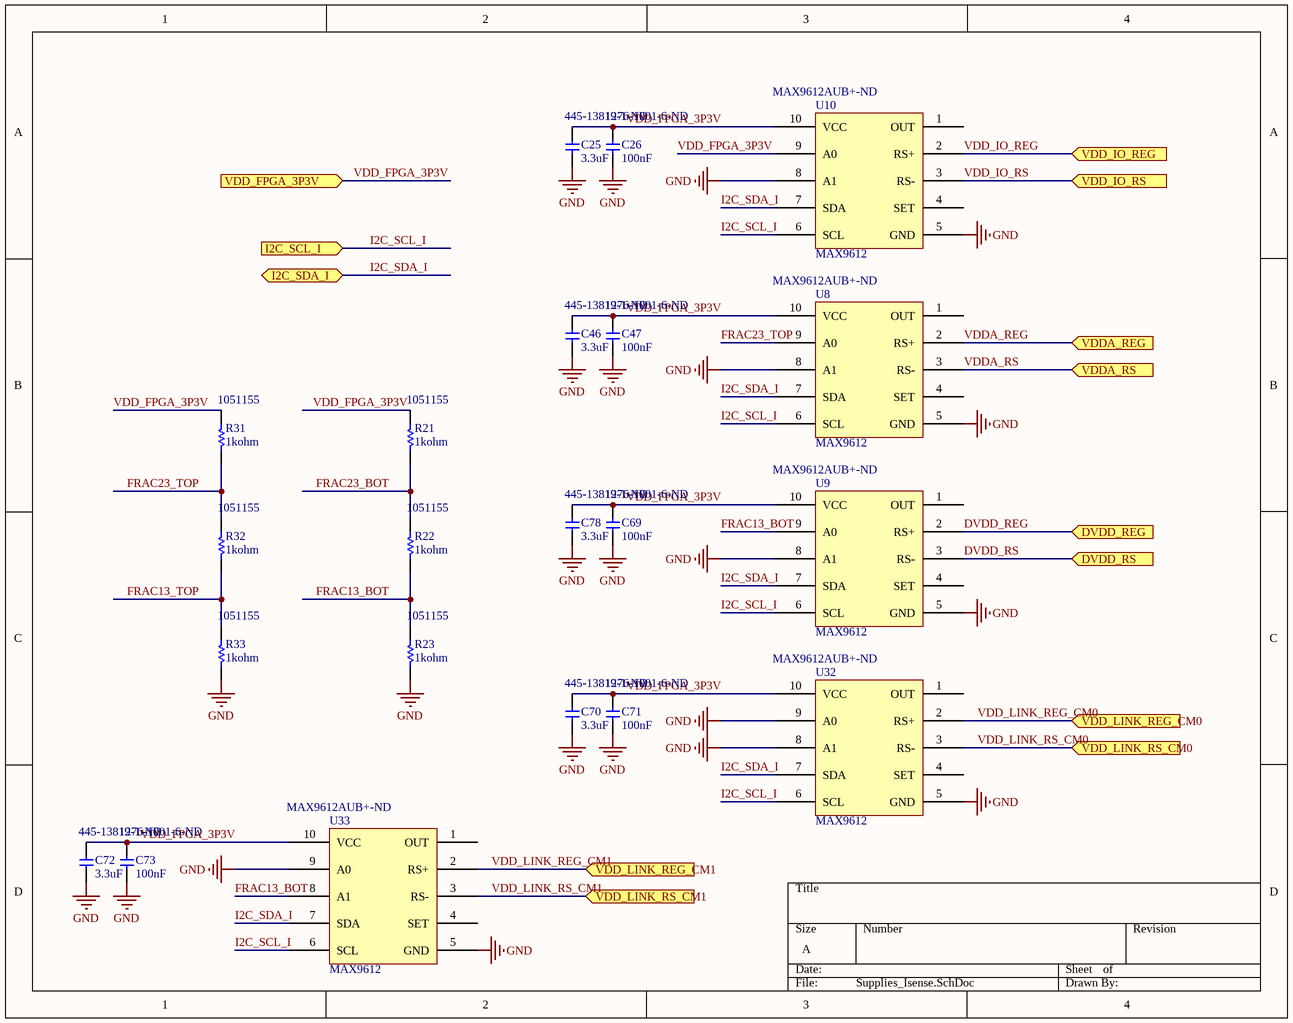
[diagram p8: Supplies_Isense.SchDoc]

### Parts
C25  3.3uF  Supplier Part Number 1: 445-13819-1-ND  [CAP_0402]
C26  100nF  Supplier Part Number 1: 1276-1001-6-ND  [CAP_0402]
C46  3.3uF  Supplier Part Number 1: 445-13819-1-ND  [CAP_0402]
C47  100nF  Supplier Part Number 1: 1276-1001-6-ND  [CAP_0402]
C69  100nF  Supplier Part Number 1: 1276-1001-6-ND  [CAP_0402]
C70  3.3uF  Supplier Part Number 1: 445-13819-1-ND  [CAP_0402]
C71  100nF  Supplier Part Number 1: 1276-1001-6-ND  [CAP_0402]
C72  3.3uF  Supplier Part Number 1: 445-13819-1-ND  [CAP_0402]
C73  100nF  Supplier Part Number 1: 1276-1001-6-ND  [CAP_0402]
C78  3.3uF  Supplier Part Number 1: 445-13819-1-ND  [CAP_0402]
R21  1kohm  Supplier Part Number 1: 1051155  [RES_0603]
R22  1kohm  Supplier Part Number 1: 1051155  [RES_0603]
R23  1kohm  Supplier Part Number 1: 1051155  [RES_0603]
R31  1kohm  Supplier Part Number 1: 1051155  [RES_0603]
R32  1kohm  Supplier Part Number 1: 1051155  [RES_0603]
R33  1kohm  Supplier Part Number 1: 1051155  [RES_0603]
U8  MAX9612  Supplier Part Number 1: MAX9612AUB+-ND  [MAX9612]
U9  MAX9612  Supplier Part Number 1: MAX9612AUB+-ND  [MAX9612]
U10  MAX9612  Supplier Part Number 1: MAX9612AUB+-ND  [MAX9612]
U32  MAX9612  Supplier Part Number 1: MAX9612AUB+-ND  [MAX9612]
U33  MAX9612  Supplier Part Number 1: MAX9612AUB+-ND  [MAX9612]

### Ports
DVDD_REG (in), DVDD_RS (in), I2C_SCL_I (in), I2C_SDA_I (bidir), VDD_FPGA_3P3V (in), VDD_IO_REG (in), VDD_IO_RS (in), VDD_LINK_REG_CM0 (in), VDD_LINK_REG_CM1 (in), VDD_LINK_RS_CM0 (in), VDD_LINK_RS_CM1 (in), VDDA_REG (in), VDDA_RS (in)

### Nets
GND: C25.2 C26.2 C46.2 C47.2 C69.2 C70.2 C71.2 C72.2 C73.2 C78.2 R23.2(BOT) R33.2(BOT) U8.5(GND) U8.8(A1) U9.5(GND) U9.8(A1) U10.5(GND) U10.8(A1) U32.5(GND) U32.8(A1) U32.9(A0) U33.5(GND) U33.9(A0)
DVDD_REG: U9.2(RS+) ; port DVDD_REG
DVDD_RS: U9.3(RS-) ; port DVDD_RS
FRAC13_BOT: R22.2(BOT) R23.1(TOP) U9.9(A0) U33.8(A1)
FRAC13_TOP: R32.2(BOT) R33.1(TOP)
FRAC23_BOT: R21.2(BOT) R22.1(TOP)
FRAC23_TOP: R31.2(BOT) R32.1(TOP) U8.9(A0)
I2C_SCL_I: U8.6(SCL) U9.6(SCL) U10.6(SCL) U32.6(SCL) U33.6(SCL) ; port I2C_SCL_I
I2C_SDA_I: U8.7(SDA) U9.7(SDA) U10.7(SDA) U32.7(SDA) U33.7(SDA) ; port I2C_SDA_I
VDD_FPGA_3P3V: C25.1 C26.1 C46.1 C47.1 C69.1 C70.1 C71.1 C72.1 C73.1 C78.1 R21.1(TOP) R31.1(TOP) U8.10(VCC) U9.10(VCC) U10.9(A0) U10.10(VCC) U32.10(VCC) U33.10(VCC) ; port VDD_FPGA_3P3V
VDD_IO_REG: U10.2(RS+) ; port VDD_IO_REG
VDD_IO_RS: U10.3(RS-) ; port VDD_IO_RS
VDD_LINK_REG_CM0: U32.2(RS+) ; port VDD_LINK_REG_CM0
VDD_LINK_REG_CM1: U33.2(RS+) ; port VDD_LINK_REG_CM1
VDD_LINK_RS_CM0: U32.3(RS-) ; port VDD_LINK_RS_CM0
VDD_LINK_RS_CM1: U33.3(RS-) ; port VDD_LINK_RS_CM1
VDDA_REG: U8.2(RS+) ; port VDDA_REG
VDDA_RS: U8.3(RS-) ; port VDDA_RS

Not connected (* = marked no-connect by the designer): U8 1(OUT) 4(SET); U9 1(OUT) 4(SET); U10 1(OUT) 4(SET); U32 1(OUT) 4(SET); U33 1(OUT) 4(SET)

### Library data of the parts
C25 C46 C70 C72 C78 = cap 3p3uF: as C99 on sheet SMA_RF_CLK; Digikey ID: 445-13819-1-ND; Value: 3.3uF; Package: 0402; Supplier 1: Digi-Key
C26 C47 C69 C71 C73 = cap 100nF: CAP CER 0.1uF 10% 16V X7R 0402; Manufacturer: Samsung Electro-Mechanics; Manufacturer ID: CL05B104KO5NNNC; Digikey ID: 1276-1001-1-ND; Value: 0.1uF; Package: 0402; Supplier 1: Digi-Key
R21-R23 R31-R33 = res 1 Kohm: RES SMD 1K OHM 1% 1/10W 0603; Manufacturer: Panasonic; Manufacturer ID: ERJ-3EKF1001V; Digikey ID: P1.00KHCT-ND; Package: 0603; Supplier 1: RSComponents
U8-U10 U32 U33 = MAX9612: OpAmp ADC; Manufacturer: Maxim; Manufacturer ID: MAX9612AUB+; Digikey ID: MAX9612AUB+-ND; Supplier 1: Digi-Key